# EAGLE design Voicecard-SVF-v0.7 (EAGLE 9.6.2)

## Sheet 1 of 2
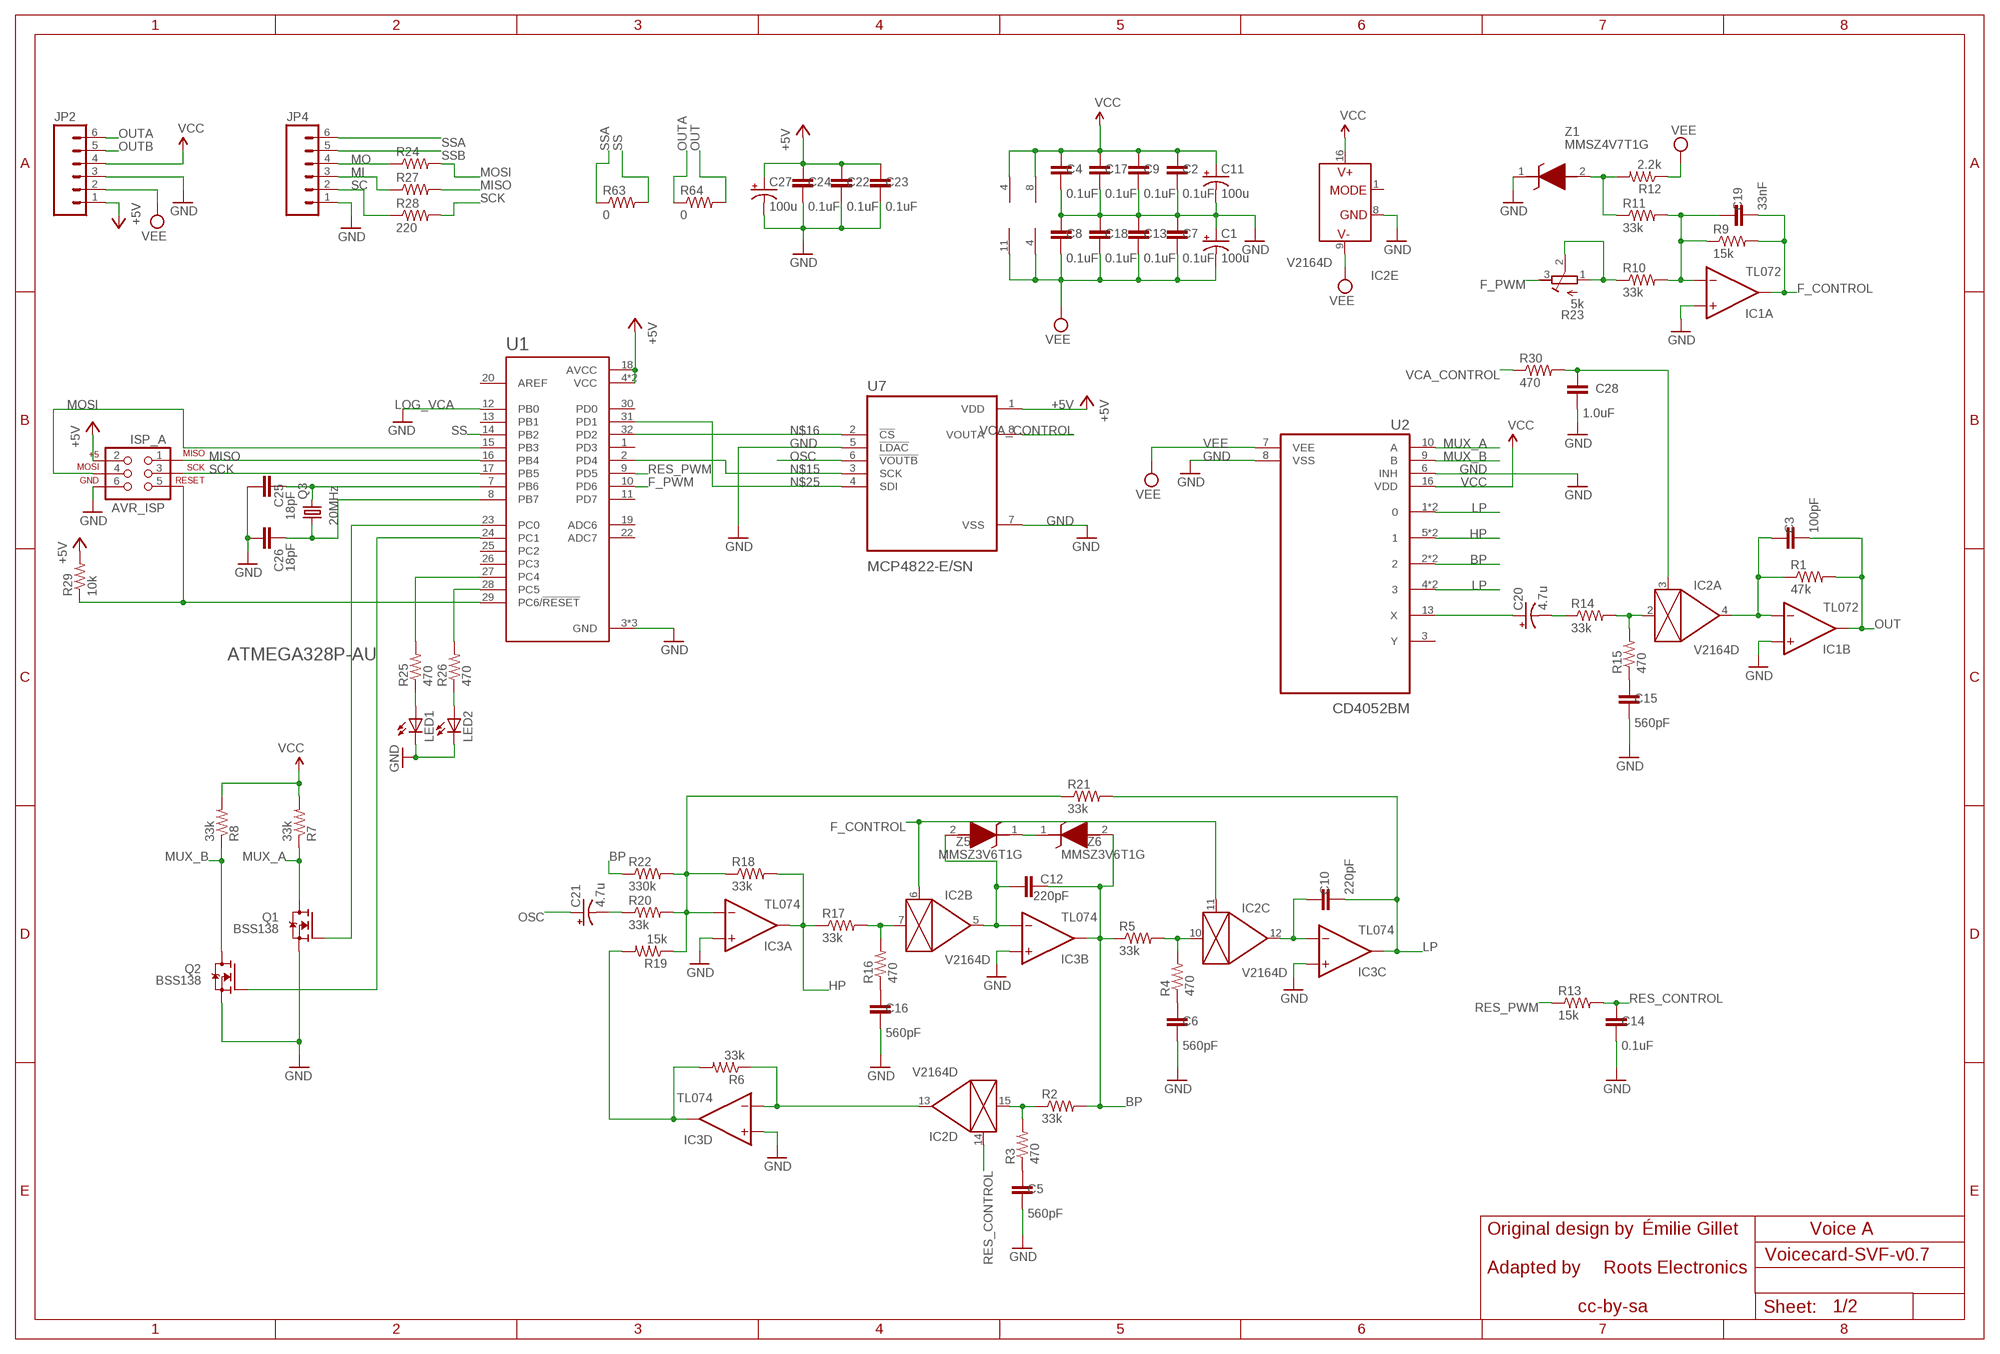
[diagram p0: schematic, sheet 1]

### Parts
C1  100u  CPOL-USC  [PANASONIC_C]
C2  0.1uF  0.1UF-0603-25V-5%  [0603]
C3  100pF  100PF-0603-50V-5%  [0603]
C4  0.1uF  0.1UF-0603-25V-5%  [0603]
C5  560pF  560PF-0603-50V-5%  [0603]
C6  560pF  560PF-0603-50V-5%  [0603]
C7  0.1uF  0.1UF-0603-25V-5%  [0603]
C8  0.1uF  0.1UF-0603-25V-5%  [0603]
C9  0.1uF  0.1UF-0603-25V-5%  [0603]
C10  220pF  270PF-0603-50V-5%  [0603]
C11  100u  CPOL-USC  [PANASONIC_C]
C12  220pF  270PF-0603-50V-5%  [0603]
C13  0.1uF  0.1UF-0603-25V-5%  [0603]
C14  0.1uF  0.1UF-0603-25V-5%  [0603]
C15  560pF  560PF-0603-50V-5%  [0603]
C16  560pF  560PF-0603-50V-5%  [0603]
C17  0.1uF  0.1UF-0603-25V-5%  [0603]
C18  0.1uF  0.1UF-0603-25V-5%  [0603]
C19  33nF  33NF-0603-50V-10%  [0603]
C20  4.7u  CPOL-USA  [PANASONIC_A]
C21  4.7u  CPOL-USA  [PANASONIC_A]
C22  0.1uF  0.1UF-0603-25V-5%  [0603]
C23  0.1uF  0.1UF-0603-25V-5%  [0603]
C24  0.1uF  0.1UF-0603-25V-5%  [0603]
C25  18pF  18PF-0603-50V-5%  [0603]
C26  18pF  18PF-0603-50V-5%  [0603]
C27  100u  CPOL-USC  [PANASONIC_C]
C28  1.0uF  1.0UF-0603-16V-10%  [0603]
IC1  TL072  TL072_SMD  [SO08]
IC2  V2164D  SSM2164S  [SOIC16N]
IC3  TL074  TL074_SMD  [SO14]
ISP_A  AVR_ISP  AVR_SPI_PRG_6PTH  [2X3]
JP2  M06SIP  [1X06]
JP4  M06SIP  [1X06]
LED1  LED3MM  [LED3MM]
LED2  LED3MM  [LED3MM]
Q1  BSS138  [SOT95P240X111-3N]
Q2  BSS138  [SOT95P240X111-3N]
Q3  20MHz  CRYSTALHC49UP  [HC49UP]
R1  47k  47KOHM-0603-1/10W-1%  [0603]
R2  33k  33KOHM-0603-1/10W-1%  [0603]
R3  470  470OHM-0603-1/10W-1%  [0603]
R4  470  470OHM-0603-1/10W-1%  [0603]
R5  33k  33KOHM-0603-1/10W-1%  [0603]
R6  33k  33KOHM-0603-1/10W-1%  [0603]
R7  33k  33KOHM-0603-1/10W-1%  [0603]
R8  33k  33KOHM-0603-1/10W-1%  [0603]
R9  15k  15KOHM-0603-1/10W-1%  [0603]
R10  33k  33KOHM-0603-1/10W-1%  [0603]
R11  33k  33KOHM-0603-1/10W-1%  [0603]
R12  2.2k  2.2KOHM-0603-1/10W-1%  [0603]
R13  15k  15KOHM-0603-1/10W-1%  [0603]
R14  33k  33KOHM-0603-1/10W-1%  [0603]
R15  470  470OHM-0603-1/10W-1%  [0603]
R16  470  470OHM-0603-1/10W-1%  [0603]
R17  33k  33KOHM-0603-1/10W-1%  [0603]
R18  33k  33KOHM-0603-1/10W-1%  [0603]
R19  15k  15KOHM-0603-1/10W-1%  [0603]
R20  33k  33KOHM-0603-1/10W-1%  [0603]
R21  33k  33KOHM-0603-1/10W-1%  [0603]
R22  330k  330KOHM-0603-1/10W-1%  [0603]
R23  5k  R-TRIMM3296P  [RTRIM3296P]
R24  220  220OHM-0603-1/10W-1%  [0603]
R25  470  470OHM-0603-1/10W-1%  [0603]
R26  470  470OHM-0603-1/10W-1%  [0603]
R27  220  220OHM-0603-1/10W-1%  [0603]
R28  220  220OHM-0603-1/10W-1%  [0603]
R29  10k  10KOHM-0603-1/10W-1%  [0603]
R30  470  470OHM-0603-1/10W-1%  [0603]
R63  0  220OHM-0603-1/10W-1%  [0603]
R64  0  220OHM-0603-1/10W-1%  [0603]
U1  ATMEGA328P-AU  [QFP80P900X900X120-32N]
U2  CD4052BM  [SOIC127P600X175-16N]
U7  MCP4822-E/SN  [SOIC127P599X175-8N]
Z1  MMSZ4V7T1G  [SOD3716X135N]
Z5  MMSZ3V6T1G  [SOD3716X135N]
Z6  MMSZ3V6T1G  [SOD3716X135N]

### Nets
+5V: C22.1 C23.1 C24.1 C27.+ ISP_A.2 JP2.1 R29.2 U1.4(VCC) U1.6(VCC) U1.18(AVCC) U7.1(VDD) ; also sheet 2
BP: C12.2 IC3.7(B:OUT) R2.2 R5.1 R22.1 U2.2 U2.15 Z6.2(A)
F_CONTROL: C19.2 IC1.1(A:OUT) IC2.6(B:CTRL) IC2.11(C:CTRL) R9.2
F_PWM: R23.3(A) U1.10(PD6)
GND: C1.+ C2.2 C4.2 C5.2 C6.2 C7.1 C8.1 C9.2 C11.- C13.1 C14.2 C15.2 C16.2 C17.2 C18.1 C22.2 C23.2 C24.2 C25.1 C26.1 C27.- C28.2 IC1.3(A:+IN) IC1.5(B:+IN) IC2.8(E:GND) IC3.3(A:+IN) IC3.5(B:+IN) IC3.10(C:+IN) IC3.12(D:+IN) ISP_A.6 JP2.3 JP4.1 LED1.K(C) LED2.K(C) Q1.2(S) Q2.2(S) U1.3(GND) U1.5(GND) U1.12(PB0) U1.21(GND) U2.6(INH) U2.8(VSS) U7.5(!LDAC) U7.7(VSS) Z1.1(K) ; also sheet 2
HP: IC3.1(A:OUT) R17.1 R18.2 U2.5 U2.14
LEDS0: R25.2 U1.27(PC4)
LP: C10.2 IC3.8(C:OUT) R21.2 U2.1 U2.4 U2.11 U2.12
MI: JP4.3 R27.1 ; also sheet 2
MISO: ISP_A.1 R27.2 U1.16(PB4)
MO: JP4.4 R24.1 ; also sheet 2
MOSI: ISP_A.4 R24.2 U1.15(PB3)
MUX_A: Q1.3(D) R7.1 U2.10(A)
MUX_B: Q2.3(D) R8.1 U2.9(B)
N$1: C21.- R20.1
N$2: C20.+ U2.13(X)
N$4: Q1.1(G) U1.23(PC0)
N$5: C20.- R14.1
N$6: Q2.1(G) U1.24(PC1)
N$7: LED1.A R25.1
N$9: R11.1 R12.2 Z1.2(A)
N$10: LED2.A R26.1
N$11: R26.2 U1.28(PC5)
N$12: IC3.2(A:-IN) R18.1 R19.1 R20.2 R21.1 R22.2
N$15: U1.2(PD4) U7.3(SCK)
N$16: U1.32(PD2) U7.2(!CS)
N$17: C6.1 R4.1
N$19: C12.1 IC2.5(B:OUT) IC3.6(B:-IN) Z5.2(A)
N$21: IC2.15(D:IN) R2.1 R3.2
N$23: ISP_A.5 R29.1 U1.29(PC6/!RESET)
N$25: U1.31(PD1) U7.4(SDI)
N$26: IC2.10(C:IN) R4.2 R5.2
N$27: C5.1 R3.1
N$28: C10.1 IC2.12(C:OUT) IC3.9(C:-IN)
N$29: IC2.7(B:IN) R16.2 R17.2
N$30: C16.1 R16.1
N$31: IC2.13(D:OUT) IC3.13(D:-IN) R6.1
N$40: C19.1 IC1.2(A:-IN) R9.1 R10.2 R11.2
N$41: R10.1 R23.1(E) R23.2(S)
N$48: IC3.14(D:OUT) R6.2 R19.2
N$59: Z5.1(K) Z6.1(K)
N$65: C15.1 R15.1
N$67: IC2.2(A:IN) R14.2 R15.2
N$77: C3.1 IC1.6(B:-IN) IC2.4(A:OUT) R1.1
N$82: C26.2 Q3.1 U1.8(PB7)
N$83: C25.2 Q3.2 U1.7(PB6)
NET55: C28.1 IC2.3(A:CTRL) R30.2
OSC: C21.+ U7.6(!VOUTB)
OUT: C3.2 IC1.7(B:OUT) R1.2 R64.2
OUTA: JP2.6 R64.1
OUTB: JP2.5 ; also sheet 2
RES_CONTROL: C14.1 IC2.14(D:CTRL) R13.2
RES_PWM: R13.1 U1.9(PD5)
SC: JP4.2 R28.1 ; also sheet 2
SCK: ISP_A.3 R28.2 U1.17(PB5)
SS: R63.2 U1.14(PB2)
SSA: JP4.6 R63.1
SSB: JP4.5 ; also sheet 2
VCA_CONTROL: R30.1 U7.8(VOUTA)
VCC: C2.1 C4.1 C9.1 C11.+ C17.1 IC1.8(P:V+) IC2.16(E:V+) IC3.4(P:V+) JP2.4 R7.2 R8.2 U2.16(VDD) ; also sheet 2
VEE: C1.- C7.2 C8.2 C13.2 C18.2 IC1.4(P:V-) IC2.9(E:V-) IC3.11(P:V-) JP2.2 R12.1 U2.7(VEE) ; also sheet 2
Unconnected: IC2.1(E:MODE) U1.1(PD3) U1.11(PD7) U1.13(PB1) U1.19(ADC6) U1.20(AREF) U1.22(ADC7) U1.25(PC2) U1.26(PC3) U1.30(PD0) U2.3(Y)

### Notes on the sheet
- LOG_VCA
- Original design by | Émilie Gillet | Voice A
- Adapted by | Roots Electronics
- cc-by-sa

## Sheet 2 of 2
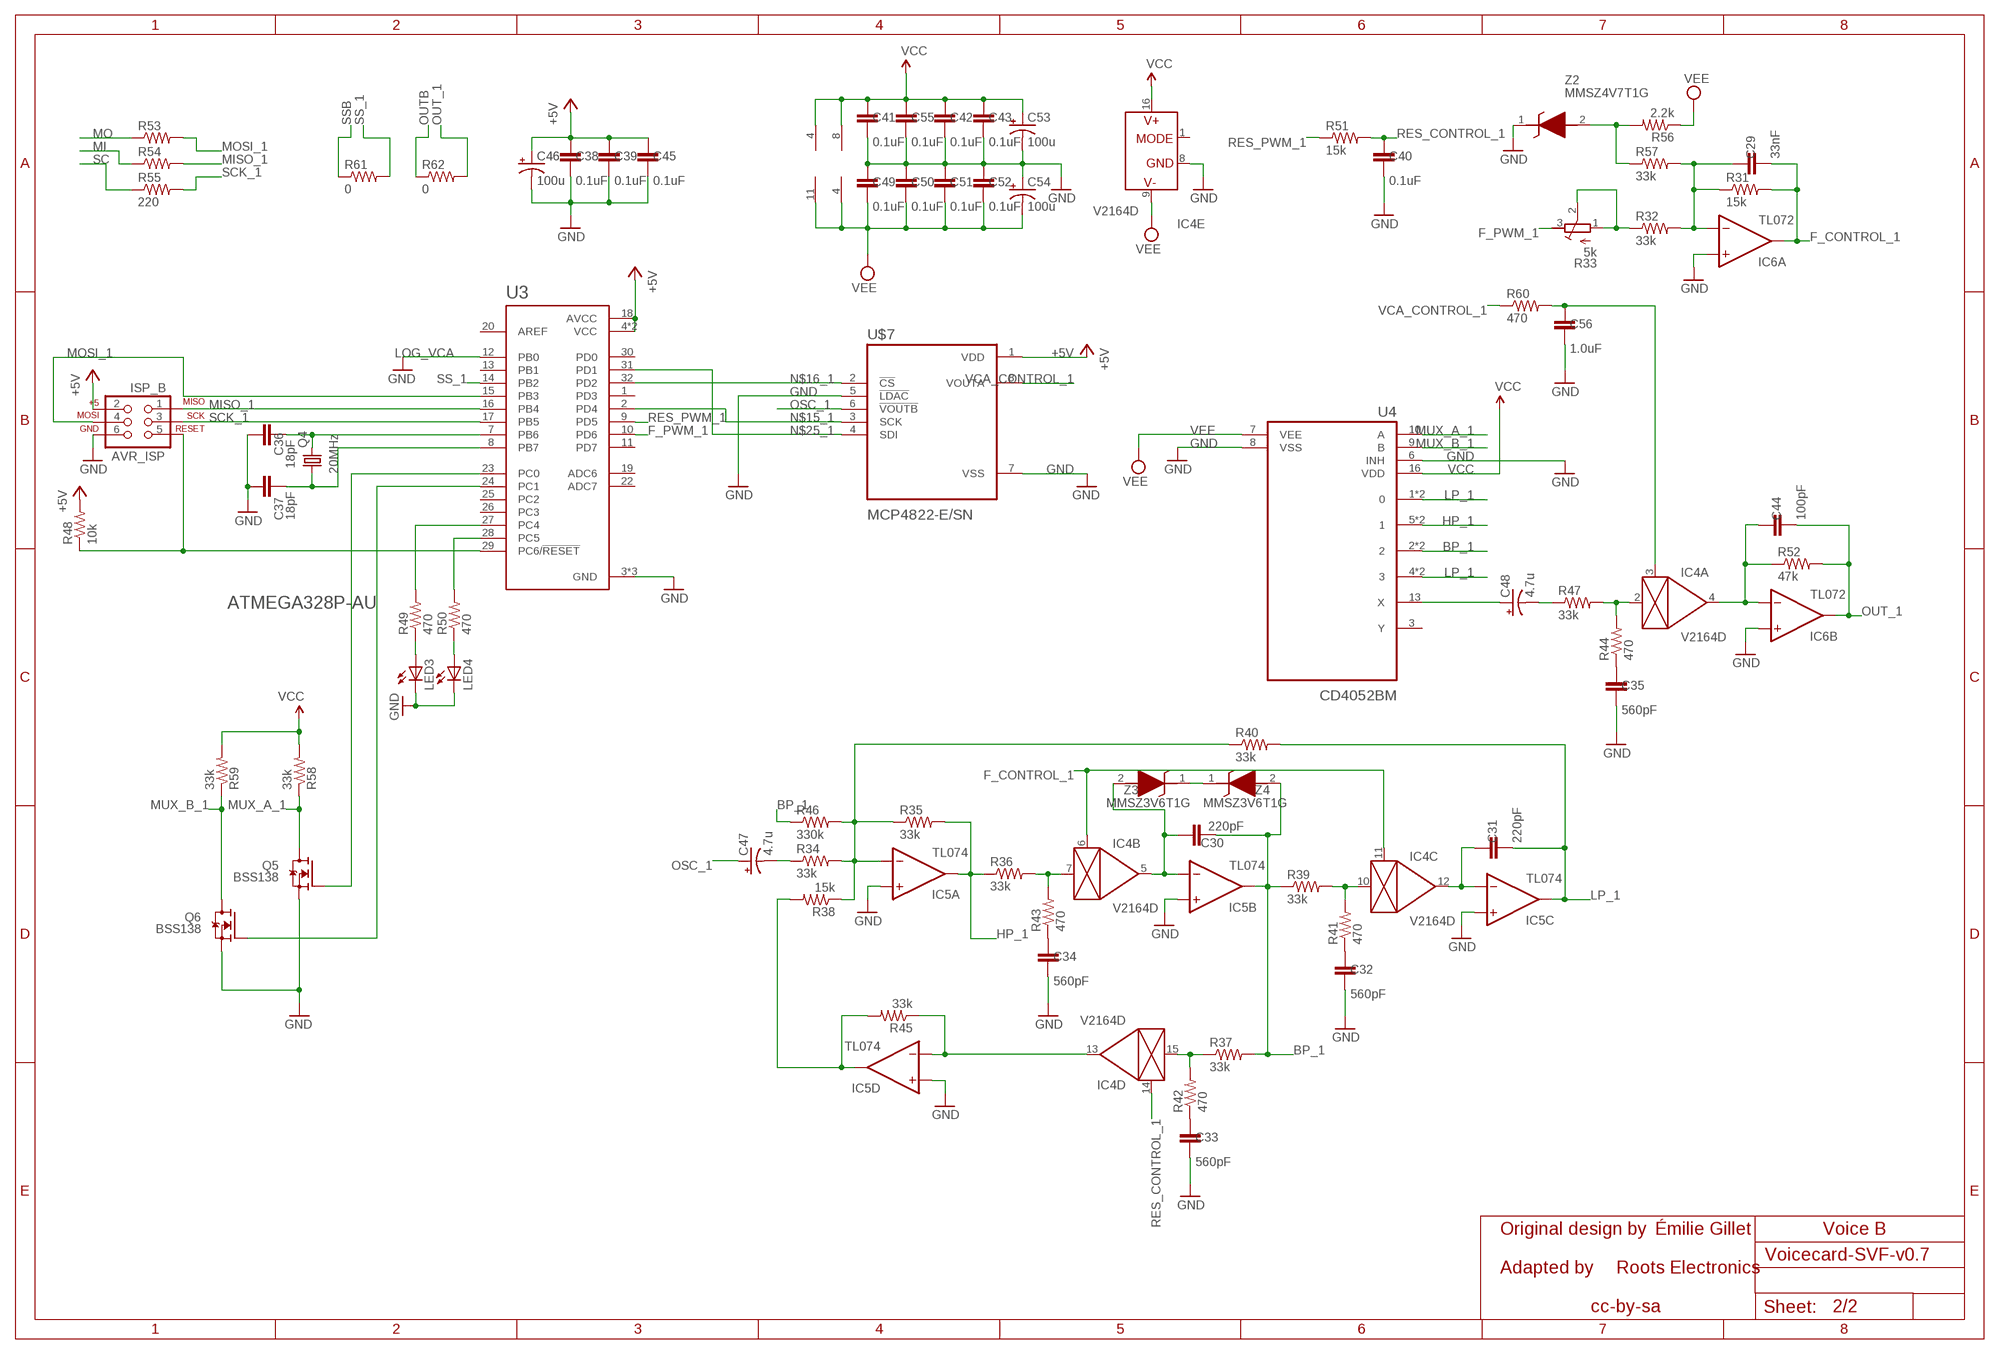
[diagram p1: schematic, sheet 2]

### Parts
C29  33nF  33NF-0603-50V-10%  [0603]
C30  220pF  270PF-0603-50V-5%  [0603]
C31  220pF  270PF-0603-50V-5%  [0603]
C32  560pF  560PF-0603-50V-5%  [0603]
C33  560pF  560PF-0603-50V-5%  [0603]
C34  560pF  560PF-0603-50V-5%  [0603]
C35  560pF  560PF-0603-50V-5%  [0603]
C36  18pF  18PF-0603-50V-5%  [0603]
C37  18pF  18PF-0603-50V-5%  [0603]
C38  0.1uF  0.1UF-0603-25V-5%  [0603]
C39  0.1uF  0.1UF-0603-25V-5%  [0603]
C40  0.1uF  0.1UF-0603-25V-5%  [0603]
C41  0.1uF  0.1UF-0603-25V-5%  [0603]
C42  0.1uF  0.1UF-0603-25V-5%  [0603]
C43  0.1uF  0.1UF-0603-25V-5%  [0603]
C44  100pF  100PF-0603-50V-5%  [0603]
C45  0.1uF  0.1UF-0603-25V-5%  [0603]
C46  100u  CPOL-USC  [PANASONIC_C]
C47  4.7u  CPOL-USA  [PANASONIC_A]
C48  4.7u  CPOL-USA  [PANASONIC_A]
C49  0.1uF  0.1UF-0603-25V-5%  [0603]
C50  0.1uF  0.1UF-0603-25V-5%  [0603]
C51  0.1uF  0.1UF-0603-25V-5%  [0603]
C52  0.1uF  0.1UF-0603-25V-5%  [0603]
C53  100u  CPOL-USC  [PANASONIC_C]
C54  100u  CPOL-USC  [PANASONIC_C]
C55  0.1uF  0.1UF-0603-25V-5%  [0603]
C56  1.0uF  1.0UF-0603-16V-10%  [0603]
IC4  V2164D  SSM2164S  [SOIC16N]
IC5  TL074  TL074_SMD  [SO14]
IC6  TL072  TL072_SMD  [SO08]
ISP_B  AVR_ISP  AVR_SPI_PRG_6PTH  [2X3]
LED3  LED3MM  [LED3MM]
LED4  LED3MM  [LED3MM]
Q4  20MHz  CRYSTALHC49UP  [HC49UP]
Q5  BSS138  [SOT95P240X111-3N]
Q6  BSS138  [SOT95P240X111-3N]
R31  15k  15KOHM-0603-1/10W-1%  [0603]
R32  33k  33KOHM-0603-1/10W-1%  [0603]
R33  5k  R-TRIMM3296P  [RTRIM3296P]
R34  33k  33KOHM-0603-1/10W-1%  [0603]
R35  33k  33KOHM-0603-1/10W-1%  [0603]
R36  33k  33KOHM-0603-1/10W-1%  [0603]
R37  33k  33KOHM-0603-1/10W-1%  [0603]
R38  15k  15KOHM-0603-1/10W-1%  [0603]
R39  33k  33KOHM-0603-1/10W-1%  [0603]
R40  33k  33KOHM-0603-1/10W-1%  [0603]
R41  470  470OHM-0603-1/10W-1%  [0603]
R42  470  470OHM-0603-1/10W-1%  [0603]
R43  470  470OHM-0603-1/10W-1%  [0603]
R44  470  470OHM-0603-1/10W-1%  [0603]
R45  33k  33KOHM-0603-1/10W-1%  [0603]
R46  330k  330KOHM-0603-1/10W-1%  [0603]
R47  33k  33KOHM-0603-1/10W-1%  [0603]
R48  10k  10KOHM-0603-1/10W-1%  [0603]
R49  470  470OHM-0603-1/10W-1%  [0603]
R50  470  470OHM-0603-1/10W-1%  [0603]
R51  15k  15KOHM-0603-1/10W-1%  [0603]
R52  47k  47KOHM-0603-1/10W-1%  [0603]
R53  220  220OHM-0603-1/10W-1%  [0603]
R54  220  220OHM-0603-1/10W-1%  [0603]
R55  220  220OHM-0603-1/10W-1%  [0603]
R56  2.2k  2.2KOHM-0603-1/10W-1%  [0603]
R57  33k  33KOHM-0603-1/10W-1%  [0603]
R58  33k  33KOHM-0603-1/10W-1%  [0603]
R59  33k  33KOHM-0603-1/10W-1%  [0603]
R60  470  470OHM-0603-1/10W-1%  [0603]
R61  0  220OHM-0603-1/10W-1%  [0603]
R62  0  220OHM-0603-1/10W-1%  [0603]
U3  ATMEGA328P-AU  [QFP80P900X900X120-32N]
U4  CD4052BM  [SOIC127P600X175-16N]
U$7  MCP4822-E/SN  [SOIC127P599X175-8N]
Z2  MMSZ4V7T1G  [SOD3716X135N]
Z3  MMSZ3V6T1G  [SOD3716X135N]
Z4  MMSZ3V6T1G  [SOD3716X135N]

### Nets
+5V: C38.1 C39.1 C45.1 C46.+ ISP_B.2 R48.2 U3.4(VCC) U3.6(VCC) U3.18(AVCC) U$7.1(VDD) ; also sheet 1
BP_1: C30.2 IC5.7(B:OUT) R37.2 R39.1 R46.1 U4.2 U4.15 Z4.2(A)
F_CONTROL_1: C29.2 IC4.6(B:CTRL) IC4.11(C:CTRL) IC6.1(A:OUT) R31.2
F_PWM_1: R33.3(A) U3.10(PD6)
GND: C32.2 C33.2 C34.2 C35.2 C36.1 C37.1 C38.2 C39.2 C40.2 C41.2 C42.2 C43.2 C45.2 C46.- C49.1 C50.1 C51.1 C52.1 C53.- C54.+ C55.2 C56.2 IC4.8(E:GND) IC5.3(A:+IN) IC5.5(B:+IN) IC5.10(C:+IN) IC5.12(D:+IN) IC6.3(A:+IN) IC6.5(B:+IN) ISP_B.6 LED3.K(C) LED4.K(C) Q5.2(S) Q6.2(S) U3.3(GND) U3.5(GND) U3.12(PB0) U3.21(GND) U4.6(INH) U4.8(VSS) U$7.5(!LDAC) U$7.7(VSS) Z2.1(K) ; also sheet 1
HP_1: IC5.1(A:OUT) R35.2 R36.1 U4.5 U4.14
LEDS1_1: R49.2 U3.27(PC4)
LP_1: C31.2 IC5.8(C:OUT) R40.2 U4.1 U4.4 U4.11 U4.12
MI: R54.1 ; also sheet 1
MISO_1: ISP_B.1 R54.2 U3.16(PB4)
MO: R53.1 ; also sheet 1
MOSI_1: ISP_B.4 R53.2 U3.15(PB3)
MUX_A_1: Q5.3(D) R58.1 U4.10(A)
MUX_B_1: Q6.3(D) R59.1 U4.9(B)
N$3: C29.1 IC6.2(A:-IN) R31.1 R32.2 R57.2
N$8: R32.1 R33.1(E) R33.2(S)
N$13: C44.1 IC4.4(A:OUT) IC6.6(B:-IN) R52.1
N$14: IC5.2(A:-IN) R34.2 R35.1 R38.1 R40.1 R46.2
N$15_1: U3.2(PD4) U$7.3(SCK)
N$16_1: U3.32(PD2) U$7.2(!CS)
N$18: C30.1 IC4.5(B:OUT) IC5.6(B:-IN) Z3.2(A)
N$20: IC4.10(C:IN) R39.2 R41.2
N$22: C31.1 IC4.12(C:OUT) IC5.9(C:-IN)
N$24: C32.1 R41.1
N$25_1: U3.31(PD1) U$7.4(SDI)
N$32: C33.1 R42.1
N$33: IC4.7(B:IN) R36.2 R43.2
N$34: C34.1 R43.1
N$35: C35.1 R44.1
N$36: IC4.2(A:IN) R44.2 R47.2
N$37: IC4.15(D:IN) R37.1 R42.2
N$38: IC4.13(D:OUT) IC5.13(D:-IN) R45.1
N$39: IC5.14(D:OUT) R38.2 R45.2
N$42: Z3.1(K) Z4.1(K)
N$43: C47.- R34.1
N$44: C48.- R47.1
N$45: C37.2 Q4.1 U3.8(PB7)
N$46: C36.2 Q4.2 U3.7(PB6)
N$47: LED3.A R49.1
N$49: LED4.A R50.1
N$50: R50.2 U3.28(PC5)
N$51: R56.2 R57.1 Z2.2(A)
N$52: ISP_B.5 R48.1 U3.29(PC6/!RESET)
N$53: Q5.1(G) U3.23(PC0)
N$54: Q6.1(G) U3.24(PC1)
N$56: C48.+ U4.13(X)
NET1: C56.1 IC4.3(A:CTRL) R60.2
OSC_1: C47.+ U$7.6(!VOUTB)
OUT_1: C44.2 IC6.7(B:OUT) R52.2 R62.2
OUTB: R62.1 ; also sheet 1
RES_CONTROL_1: C40.1 IC4.14(D:CTRL) R51.2
RES_PWM_1: R51.1 U3.9(PD5)
SC: R55.1 ; also sheet 1
SCK_1: ISP_B.3 R55.2 U3.17(PB5)
SS_1: R61.2 U3.14(PB2)
SSB: R61.1 ; also sheet 1
VCA_CONTROL_1: R60.1 U$7.8(VOUTA)
VCC: C41.1 C42.1 C43.1 C53.+ C55.1 IC4.16(E:V+) IC5.4(P:V+) IC6.8(P:V+) R58.2 R59.2 U4.16(VDD) ; also sheet 1
VEE: C49.2 C50.2 C51.2 C52.2 C54.- IC4.9(E:V-) IC5.11(P:V-) IC6.4(P:V-) R56.1 U4.7(VEE) ; also sheet 1
Unconnected: IC4.1(E:MODE) U3.1(PD3) U3.11(PD7) U3.13(PB1) U3.19(ADC6) U3.20(AREF) U3.22(ADC7) U3.25(PC2) U3.26(PC3) U3.30(PD0) U4.3(Y)

### Notes on the sheet
- LOG_VCA
- Original design by | Émilie Gillet | Voice B
- Adapted by | Roots Electronics
- cc-by-sa

## Library data of the parts
C1 C11 C20 C21 C27 C46-C48 C53 C54 = adafruit:CPOL-US: POLARIZED CAPACITOR, American symbol
C2 C4 C7-C9 C13 C14 C17 C18 C22-C24 C38-C43 C45 C49-C52 C55 = SparkFun-Capacitors:0.1UF: 0.1µF ceramic capacitors A capacitor is a passive two-terminal electrical component used to store electrical energy temporarily in an electric field.; PROD_ID: CAP-08604
C3 C44 = SparkFun-Capacitors:100PF: 100pF/0.1nF ceramic capacitors A capacitor is a passive two-terminal electrical component used to store electrical energy temporarily in an electric field.; PROD_ID: CAP-07883
C5 C6 C15 C16 C32-C35 = SparkFun-Capacitors:560PF: 0.56nF/560pF ceramic capacitors A capacitor is a passive two-terminal electrical component used to store electrical energy temporarily in an electric field.; PROD_ID: CAP-08749
C10 C12 C30 C31 = SparkFun-Capacitors:270PF: 270pF/0.27nF ceramic capacitors A capacitor is a passive two-terminal electrical component used to store electrical energy temporarily in an electric field.; PROD_ID: CAP-13339; VALUE: 270PF
C19 C29 = SparkFun-Capacitors:33NF: 33nF ceramic capacitors A capacitor is a passive two-terminal electrical component used to store electrical energy temporarily in an electric field.; PROD_ID: CAP-07887
C25 C26 C36 C37 = SparkFun-Capacitors:18PF: 18pF ceramic capacitors A capacitor is a passive two-terminal electrical component used to store electrical energy temporarily in an electric field.; PROD_ID: CAP-08267
C28 C56 = SparkFun-Capacitors:1.0UF: 1µF ceramic capacitors A capacitor is a passive two-terminal electrical component used to store electrical energy temporarily in an electric field.; PROD_ID: CAP-00868
IC1 IC6 = MusicThingModular:TL072: Generic Dual Op Amp
IC2 IC4 = ssm2164_2:SSM2164
IC3 IC5 = MusicThingModular:TL074: Generic Quad Op Amp
ISP_A ISP_B = SparkFun:AVR_SPI_PRG_6: AVR ISP 6 Pin This is the reduced ISP connector for AVR programming. Common on Arduino. This footprint will take up less PCB space and can be used with a 10-pin to 6-pin adapter such as SKU: BOB-08508
JP2 JP4 = SparkFun:M06: Header 6 Standard 6-pin 0.1" header. Use with straight break away headers (SKU : PRT-00116), right angle break away headers (PRT-00553), swiss pins (PRT-00743), machine pins (PRT-00117), and female headers (PRT-00115). Molex polarized connector foot print use with SKU : PRT-08094 with associated crimp pins and housings. NOTES ON THE VARIANTS LOCK and LOCK_LONGPADS... This footprint was designed to help hold the alignment of a through-hole component (i.e. 6-pin header) while soldering it into place. You may notice that each hole has been shifted either up or down by 0.005 of an inch from it's more standard position (which is a perfectly straight line). This slight alteration caused the pins (the squares in the middle) to touch the edges of the holes. Because they are alternating, it causes a "brace" to hold the component in place. 0.005 has proven to be the perfect amount of "off-center" position when using our standard breakaway headers. Although looks a little odd when you look at the bare footprint, once you have a header in there, the alteration is very hard to notice. Also, if you push a header all the way into place, it is covered up entirely on the bottom side. This idea of altering the position of holes to aid alignment will be further integrated into the Sparkfun Library for other footprints. It can help hold any component with 3 or more connection pins.
LED1-LED4 = led:LED: LED OSRAM: - CHIPLED LG R971, LG N971, LY N971, LG Q971, LY Q971, LO R971, LY R971 LH N974, LH R974 LS Q976, LO Q976, LY Q976 LO Q996 - Hyper CHIPLED LW Q18S LB Q993, LB Q99A, LB R99A - SideLED LS A670, LO A670, LY A670, LG A670, LP A670 LB A673, LV A673, LT A673, LW A673 LH A674 LY A675 LS A676, LA A676, LO A676, LY A676, LW A676 LS A679, LY A679, LG A679 - Hyper Micro SIDELED® LS Y876, LA Y876, LO Y876, LY Y876 LT Y87S - SmartLED LW L88C, LW L88S LB L89C, LB L89S, LG L890 LS L89K, LO L89K, LY L89K LS L896, LA L896, LO L896, LY L896 - TOPLED LS T670, LO T670, LY T670, LG T670, LP T670 LSG T670, LSP T670, LSY T670, LOP T670, LYG T670 LG T671, LOG T671, LSG T671 LB T673, LV T673, LT T673, LW T673 LH T674 LS T676, LA T676, LO T676, LY T676, LB T676, LH T676, LSB T676, LW T676 LB T67C, LV T67C, LT T67C, LS T67K, LO T67K, LY T67K, LW E67C LS E67B, LA E67B, LO E67B, LY E67B, LB E67C, LV E67C, LT E67C LW T67C LS T679, LY T679, LG T679 LS T770, LO T770, LY T770, LG T770, LP T770 LB T773, LV T773, LT T773, LW T773 LH T774 LS E675, LA E675, LY E675, LS T675 LS T776, LA T776, LO T776, LY T776, LB T776 LHGB T686 LT T68C, LB T68C - Hyper Mini TOPLED® LB M676 - Mini TOPLED Santana® LG M470 LS M47K, LO M47K, LY M47K Source: http://www.osram.convergy.de LUXEON: - LUMILED® LXK2-PW12-R00, LXK2-PW12-S00, LXK2-PW14-U00, LXK2-PW14-V00 LXK2-PM12-R00, LXK2-PM12-S00, LXK2-PM14-U00 LXK2-PE12-Q00, LXK2-PE12-R00, LXK2-PE12-S00, LXK2-PE14-T00, LXK2-PE14-U00 LXK2-PB12-K00, LXK2-PB12-L00, LXK2-PB12-M00, LXK2-PB14-N00, LXK2-PB14-P00, LXK2-PB14-Q00 LXK2-PR12-L00, LXK2-PR12-M00, LXK2-PR14-Q00, LXK2-PR14-R00 LXK2-PD12-Q00, LXK2-PD12-R00, LXK2-PD12-S00 LXK2-PH12-R00, LXK2-PH12-S00 LXK2-PL12-P00, LXK2-PL12-Q00, LXK2-PL12-R00 Source: www.luxeon.com KINGBRIGHT: KA-3528ASYC Source: www.kingbright.com
Q1 Q2 Q5 Q6 = BSS138:BSS138: N-Channel 50V 220mA (Ta) 360mW (Ta) Surface Mount SOT-23-3 Check prices <https://pricing.snapeda.com/parts/BSS138/ON%20Semiconductor/view-part?ref=eda>; AVAILABILITY: Good; DESCRIPTION: N-Channel 50V 220mA (Ta) 360mW (Ta) Surface Mount SOT-23-3; MF: ON Semiconductor; MP: BSS138; PACKAGE: SOT-23 ON Semiconductor; PRICE: None; PURCHASE-URL: https://pricing.snapeda.com/search/part/BSS138/?ref=eda
Q3 Q4 = crystal:CRYSTAL: CRYSTAL; OC_FARNELL: unknown; OC_NEWARK: unknown
R1 R52 = SparkFun-Resistors:47KOHM: 47kΩ resistor A resistor is a passive two-terminal electrical component that implements electrical resistance as a circuit element. Resistors act to reduce current flow, and, at the same time, act to lower voltage levels within circuits. - Wikipedia; PROD_ID: RES-07871
R2 R5-R8 R10 R11 R14 R17 R18 R20 R21 R32 R34-R37 R39 R40 R45 R47 R57-R59 = SparkFun-Resistors:33KOHM: 33kΩ resistor A resistor is a passive two-terminal electrical component that implements electrical resistance as a circuit element. Resistors act to reduce current flow, and, at the same time, act to lower voltage levels within circuits. - Wikipedia; PROD_ID: RES-08416
R3 R4 R15 R16 R25 R26 R30 R41-R44 R49 R50 R60 = SparkFun-Resistors:470OHM: 470Ω resistor A resistor is a passive two-terminal electrical component that implements electrical resistance as a circuit element. Resistors act to reduce current flow, and, at the same time, act to lower voltage levels within circuits. - Wikipedia; PROD_ID: RES-07869
R9 R13 R19 R31 R38 R51 = SparkFun-Resistors:15KOHM: 15kΩ resistor A resistor is a passive two-terminal electrical component that implements electrical resistance as a circuit element. Resistors act to reduce current flow, and, at the same time, act to lower voltage levels within circuits. - Wikipedia; PROD_ID: RES-07854
R12 R56 = SparkFun-Resistors:2.2KOHM: 2.2kΩ resistor A resistor is a passive two-terminal electrical component that implements electrical resistance as a circuit element. Resistors act to reduce current flow, and, at the same time, act to lower voltage levels within circuits. - Wikipedia; PROD_ID: RES-08272
R22 R46 = SparkFun-Resistors:330KOHM: 330kΩ resistor A resistor is a passive two-terminal electrical component that implements electrical resistance as a circuit element. Resistors act to reduce current flow, and, at the same time, act to lower voltage levels within circuits. - Wikipedia; PROD_ID: RES-08968
R23 R33 = rcl:R-TRIMM: Trimm resistor
R24 R27 R28 R53-R55 = SparkFun-Resistors:220OHM: 220Ω resistor A resistor is a passive two-terminal electrical component that implements electrical resistance as a circuit element. Resistors act to reduce current flow, and, at the same time, act to lower voltage levels within circuits. - Wikipedia; PROD_ID: RES-07861
R29 R48 = SparkFun-Resistors:10KOHM: 10kΩ resistor A resistor is a passive two-terminal electrical component that implements electrical resistance as a circuit element. Resistors act to reduce current flow, and, at the same time, act to lower voltage levels within circuits. - Wikipedia; PROD_ID: RES-00824
R61-R64 = SparkFun-Resistors:220OHM: 220Ω resistor A resistor is a passive two-terminal electrical component that implements electrical resistance as a circuit element. Resistors act to reduce current flow, and, at the same time, act to lower voltage levels within circuits. - Wikipedia; PROD_ID: RES-07861; VALUE: 220
U1 U3 = ATMEGA328P-AU:ATMEGA328P-AU: ATmega Series 20 MHz 32 KB Flash 2 KB SRAM 8-Bit Microcontroller - TQFP-32 Check prices <https://pricing.snapeda.com/parts/ATMEGA328P-AU/Microchip%20Technology/view-part?ref=eda>; AVAILABILITY: Good; DESCRIPTION: IC MCU 8BIT 32KB FLASH 32TQFP; MF: Microchip Technology; MP: ATMEGA328P-AU; PACKAGE: TQFP-32 Microchip Technology; PRICE: None; PURCHASE-URL: https://pricing.snapeda.com/search/part/ATMEGA328P-AU/?ref=eda
U2 U4 = CD4052BM:CD4052BM: Check prices <https://pricing.snapeda.com/parts/CD4052BM/Texas%20Instruments/view-part?ref=eda>; AVAILABILITY: Good; DESCRIPTION: 20-V, 4:1, 2-channel general-purpose multiplexer 16-SOIC -55 to 125; MF: Texas Instruments; MP: CD4052BM; PACKAGE: SOIC-16 Texas Instruments; PRICE: None; PURCHASE-URL: https://pricing.snapeda.com/search/part/CD4052BM/?ref=eda
U7 U$7 = MCP4822-E_SN:MCP4822-E/SN: Check prices <https://pricing.snapeda.com/parts/MCP4822-E/SN/Microchip/view-part?ref=eda>; AVAILABILITY: Good; DESCRIPTION: 12 Bit Digital to Analog Converter 2 8-SOIC; MF: Microchip; MP: MCP4822-E/SN; PACKAGE: SOIC-8 Microchip; PRICE: None; PURCHASE-URL: https://pricing.snapeda.com/search/part/MCP4822-E/SN/?ref=eda
Z1 Z2 = SamacSys_Parts:MMSZ4V7T1G: 500 mW, 4.7 V +/-5% ZenerDiodeVoltage Regulator Source: Datasheet <http://www.onsemi.com/pub/Collateral/MMSZ2V4T1-D.PDF>; DESCRIPTION: 500 mW, 4.7 V +/-5% ZenerDiodeVoltage Regulator; HEIGHT: 1.35mm; MANUFACTURER_NAME: ON Semiconductor; MANUFACTURER_PART_NUMBER: MMSZ4V7T1G; MOUSER_PART_NUMBER: 863-MMSZ4V7T1G; MOUSER_PRICE-STOCK: https://www.mouser.co.uk/ProductDetail/ON-Semiconductor/MMSZ4V7T1G/?qs=P4IOph%252Bbot%2F%2F6Vqi0IwDZQ%3D%3D
Z3-Z6 = SamacSys_Parts:MMSZ3V6T1G: 500 mW 3.6 V +/-5% ZenerDiodeVoltage Regulator Source: Datasheet <http://www.onsemi.com/pub/Collateral/MMSZ2V4T1-D.PDF>; DESCRIPTION: 500 mW 3.6 V +/-5% ZenerDiodeVoltage Regulator; HEIGHT: 1.35mm; MANUFACTURER_NAME: ON Semiconductor; MANUFACTURER_PART_NUMBER: MMSZ3V6T1G; MOUSER_PART_NUMBER: 863-MMSZ3V6T1G; MOUSER_PRICE-STOCK: https://www.mouser.co.uk/ProductDetail/ON-Semiconductor/MMSZ3V6T1G/?qs=P4IOph%252Bbot9%252BVUKWse7g7w%3D%3D

## Board
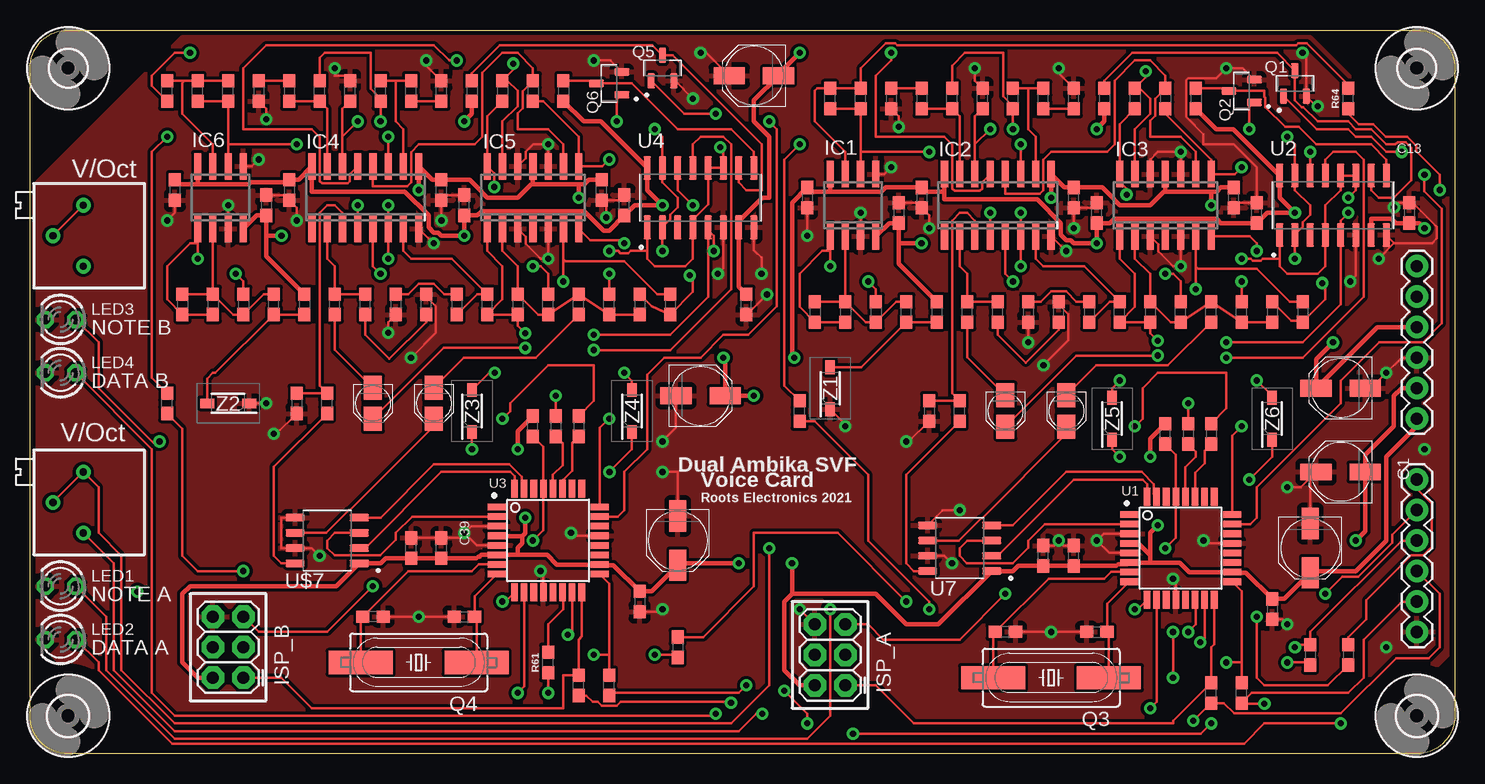
[diagram p2: board, top side]
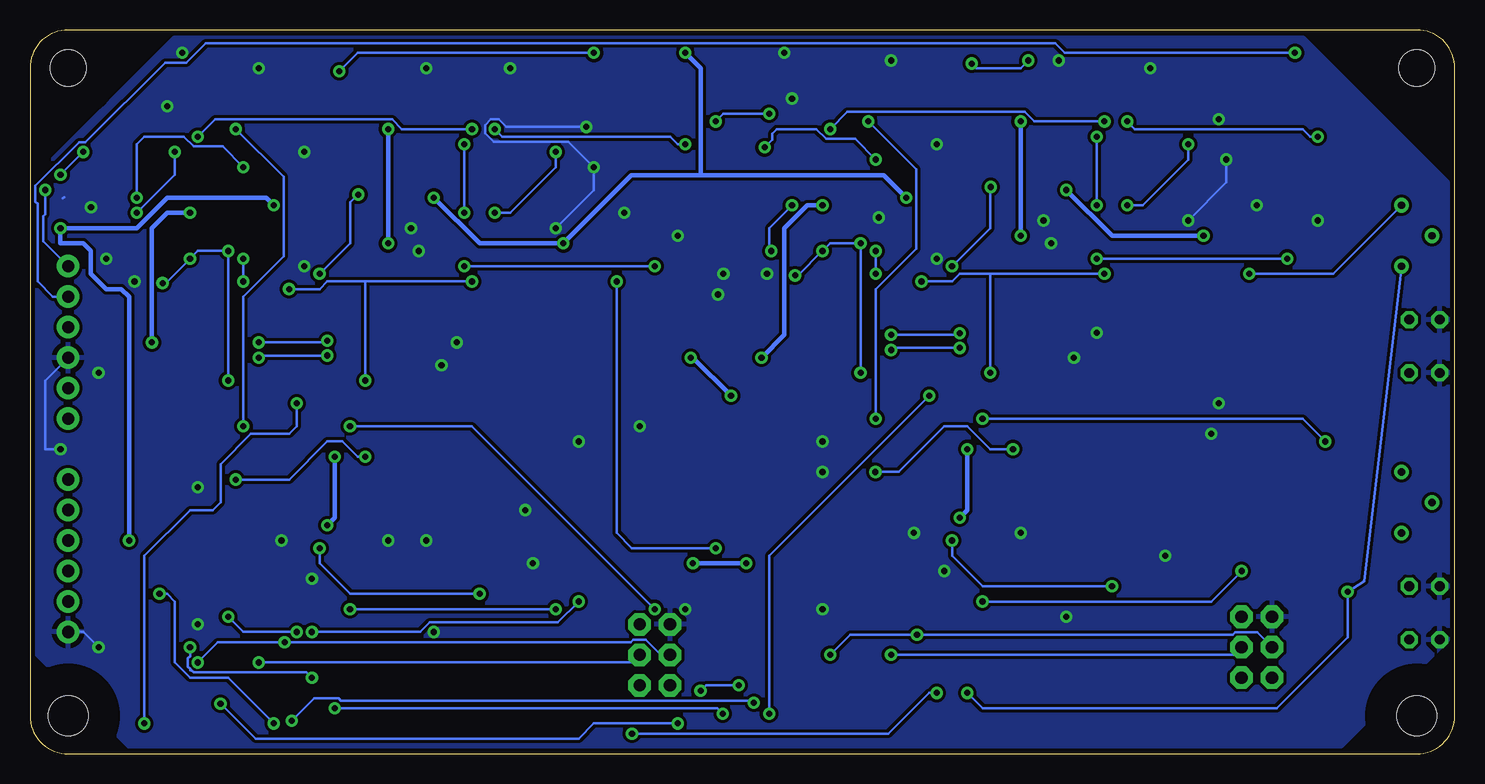
[diagram p3: board, bottom side, seen from below]

Size 118.75 x 60.33 mm. Coordinates in mm from the lower left corner, seen from the top.
Outline: 0,57.15 arc-90 3.17,60.33 115.57,60.33 arc-90 118.75,57.15 118.75,3.17 arc-90 115.57,0 3.17,0 arc-90 0,3.17 0,57.15
Copper layers (1*16): Top 0.035mm / dielectric 1.5mm / Bottom 0.035mm
Design rules "SparkFun *": minimum track width 8mil, minimum drill 20mil, track to track 8mil, track to pad 8mil, pad to pad 8mil, via to via 8mil, smd to smd 8mil, copper to edge 10mil, drill to drill 8mil, minimum pad ring 12mil, minimum via ring 10mil, stop-mask expansion 4mil, vias tented up to drill 25mil, thermal gap 16mil

### Footprints (pad centres in the part's own frame; a part is rotated, then mirrored left to right if it is on the bottom)
PANASONIC_C = smd 2.6 x 1.4: + 2.05,0; - -2.05,0
0603 = smd 1.1 x 1: 1 -0.85,0; 2 0.85,0
PANASONIC_A = smd 2 x 1.5: + 1.3,0; - -1.3,0
SO08 = smd 0.6 x 2.2: 1 -1.905,-2.6; 2 -0.635,-2.6; 3 0.635,-2.6; 4 1.905,-2.6; 5 1.905,2.6; 6 0.635,2.6; 7 -0.635,2.6; 8 -1.905,2.6
SOIC16N = smd 0.6 x 2.2: 1 -4.445,-2.6; 2 -3.175,-2.6; 3 -1.905,-2.6; 4 -0.635,-2.6; 5 0.635,-2.6; 6 1.905,-2.6; 7 3.175,-2.6; 8 4.445,-2.6; 9 4.445,2.6; 10 3.175,2.6; 11 1.905,2.6; 12 0.635,2.6; 13 -0.635,2.6; 14 -1.905,2.6; 15 -3.175,2.6; 16 -4.445,2.6
SO14 = smd 0.6 x 2.2: 1 -3.81,-2.6; 2 -2.54,-2.6; 3 -1.27,-2.6; 4 0,-2.6; 5 1.27,-2.6; 6 2.54,-2.6; 7 3.81,-2.6; 8 3.81,2.6; 9 2.54,2.6; 10 1.27,2.6; 11 0,2.6; 12 -1.27,2.6; 13 -2.54,2.6; 14 -3.81,2.6
2X3 = drill 1.016 pad 1.88 octagon: 1 0,0; 2 0,2.54; 3 2.54,0; 4 2.54,2.54; 5 5.08,0; 6 5.08,2.54
1X06 = drill 1.016 pad 1.88: 1 0,0; 2 2.54,0; 3 5.08,0; 4 7.62,0; 5 10.16,0; 6 12.7,0
LED3MM = drill 0.813 octagon: A -1.27,0; K 1.27,0
SOT95P240X111-3N = smd 1.23 x 0.6: 1 -1.06,0.95; 2 -1.06,-0.95; 3 1.06,0
HC49UP = smd 5.334 x 1.93: 1 -4.826,0; 2 4.826,0
RTRIM3296P = drill 0.61: 1 0,-2.54; 2 2.54,0; 3 0,2.54
QFP80P900X900X120-32N = smd 1.5 x 0.55: 1 -4.3,2.8; 2 -4.3,2; 3 -4.3,1.2; 4 -4.3,0.4; 5 -4.3,-0.4; 6 -4.3,-1.2; 7 -4.3,-2; 8 -4.3,-2.8; 17 4.3,-2.8; 18 4.3,-2; 19 4.3,-1.2; 20 4.3,-0.4; 21 4.3,0.4; 22 4.3,1.2; 23 4.3,2; 24 4.3,2.8 | smd 0.55 x 1.5: 9 -2.8,-4.3; 10 -2,-4.3; 11 -1.2,-4.3; 12 -0.4,-4.3; 13 0.4,-4.3; 14 1.2,-4.3; 15 2,-4.3; 16 2.8,-4.3; 25 2.8,4.3; 26 2,4.3; 27 1.2,4.3; 28 0.4,4.3; 29 -0.4,4.3; 30 -1.2,4.3; 31 -2,4.3; 32 -2.8,4.3
SOIC127P600X175-16N = smd 1.97 x 0.6: 1 -2.475,4.445; 2 -2.475,3.175; 3 -2.475,1.905; 4 -2.475,0.635; 5 -2.475,-0.635; 6 -2.475,-1.905; 7 -2.475,-3.175; 8 -2.475,-4.445; 9 2.475,-4.445; 10 2.475,-3.175; 11 2.475,-1.905; 12 2.475,-0.635; 13 2.475,0.635; 14 2.475,1.905; 15 2.475,3.175; 16 2.475,4.445
SOIC127P599X175-8N = smd 1.58 x 0.6: 1 -2.67,1.905; 2 -2.67,0.635; 3 -2.67,-0.635; 4 -2.67,-1.905; 5 2.67,-1.905; 6 2.67,-0.635; 7 2.67,0.635; 8 2.67,1.905
3,0 = hole 3: 0,0
3,3 = hole 3.3: 0,0
SOD3716X135N = smd 1.15 x 0.8: 1 -1.75,0; 2 1.75,0

### Placement (x,y rotation side)
C1  109.22,23.5 180 top
C2  88.9,45.09 90 top
C3  69.22,54.61 90 top
C4  64.77,46.36 270 top
C5  71.75,54.61 270 top
C6  87,54.61 90 top
C7  87,46.36 90 top
C8  100.33,46.36 90 top
C9  74.3,46.36 270 top
C10  94.61,54.61 270 top
C11  109.22,30.48 180 top
C12  106.05,36.83 270 top
C13  114.94,45.09 270 top
C14  79.38,54.61 90 top
C15  85.72,36.83 90 top
C16  83.19,36.83 270 top
C17  102.23,45.09 90 top
C18  72.39,45.09 270 top
C19  65.41,36.83 270 top
C20  81.28,28.57 270 top
C21  86.36,28.57 270 top
C22  87,16.51 90 top
C23  103.5,12.06 270 top
C24  84.45,16.51 90 top
C25  81.28,10.16 180 top
C26  88.9,10.16 0 top
C27  106.68,17.14 270 top
C28  74.93,28.57 270 top
C29  12.7,37.47 270 top
C30  53.34,37.47 270 top
C31  41.91,55.25 270 top
C32  34.29,55.25 90 top
C33  19.05,55.25 270 top
C34  30.48,37.47 270 top
C35  33.02,37.47 90 top
C36  28.57,11.43 180 top
C37  36.2,11.43 0 top
C38  31.75,17.14 90 top
C39  34.29,17.14 90 top
C40  26.67,55.25 90 top
C41  12.06,46.99 270 top
C42  21.59,46.99 270 top
C43  36.2,45.72 90 top
C44  16.51,55.25 90 top
C45  50.8,12.7 270 top
C46  53.98,17.78 270 top
C47  33.66,29.21 270 top
C48  28.57,29.21 270 top
C49  47.62,46.99 90 top
C50  19.68,45.72 270 top
C51  59.69,37.47 90 top
C52  34.29,46.99 90 top
C53  55.88,29.84 0 top
C54  60.33,56.52 180 top
C55  49.53,45.72 90 top
C56  22.23,29.21 270 top
IC1  68.58,45.72 0 top
IC2  80.64,45.72 0 top
IC3  94.61,45.72 0 top
IC4  27.94,46.36 0 top
IC5  41.91,46.36 0 top
IC6  15.88,46.36 0 top
ISP_A  67.94,5.71 90 top
ISP_B  17.78,6.35 90 top
JP2  115.57,27.94 90 top
JP4  115.57,10.16 90 top
LED1  2.54,13.97 180 top
LED2  2.54,9.53 180 top
LED3  2.54,36.2 180 top
LED4  2.54,31.75 180 top
Q1  105.41,55.88 90 top
Q2  100.97,55.25 180 top
Q3  85.09,6.35 180 top
Q4  32.38,7.62 180 top
Q5  52.7,57.15 90 top
Q6  48.26,55.88 180 top
R1  66.67,54.61 90 top
R2  76.83,54.61 90 top
R3  74.3,54.61 270 top
R4  84.45,54.61 90 top
R5  81.92,54.61 90 top
R6  92.08,54.61 270 top
R7  89.53,54.61 270 top
R8  97.16,54.61 270 top
R9  67.94,36.83 270 top
R10  70.48,36.83 270 top
R11  73.03,36.83 90 top
R12  75.56,36.83 270 top
R13  64.14,28.57 90 top
R14  78.11,36.83 90 top
R15  80.64,36.83 90 top
R16  88.27,36.83 270 top
R17  90.81,36.83 90 top
R18  93.34,36.83 270 top
R19  95.89,36.83 90 top
R20  98.42,36.83 90 top
R21  100.97,36.83 90 top
R22  103.5,36.83 270 top
R23  4.45,20.95 180 top
R24  106.68,8.26 270 top
R25  98.42,26.67 270 top
R26  96.52,26.67 270 top
R27  98.42,5.08 90 top
R28  100.97,5.08 90 top
R29  94.61,26.67 90 top
R30  77.47,28.57 90 top
R31  15.24,37.47 270 top
R32  17.78,37.47 270 top
R33  4.45,43.18 180 top
R34  45.72,37.47 90 top
R35  40.64,37.47 270 top
R36  38.1,37.47 90 top
R37  24.13,55.25 90 top
R38  43.18,37.47 90 top
R39  29.21,55.25 90 top
R40  48.26,37.47 90 top
R41  31.75,55.25 90 top
R42  21.59,55.25 270 top
R43  35.56,37.47 270 top
R44  27.94,37.47 90 top
R45  39.37,55.25 270 top
R46  50.8,37.47 270 top
R47  25.4,37.47 90 top
R48  41.91,27.3 90 top
R49  45.72,27.3 270 top
R50  43.81,27.3 270 top
R51  11.43,29.21 90 top
R52  13.97,55.25 90 top
R53  53.98,8.89 270 top
R54  45.72,5.71 90 top
R55  48.26,5.71 90 top
R56  22.86,37.47 270 top
R57  20.32,37.47 90 top
R58  36.83,55.25 270 top
R59  44.45,55.25 270 top
R60  24.77,29.21 90 top
R61  43.18,7.62 90 top
R62  11.43,55.25 90 top
R63  109.86,8.26 270 top
R64  109.86,54.61 90 top
U1  95.89,17.14 0 top
U2  108.58,45.72 90 top
U3  43.18,17.78 0 top
U4  55.88,46.36 90 top
U7  77.47,17.14 180 top
U$1  [3,0]  3.17,57.15 0 top
U$2  [3,0]  115.57,57.15 0 top
U$5  [3,3]  3.17,3.17 0 top
U$6  [3,3]  115.57,3.17 0 top
U$7  24.77,17.78 180 top
Z1  66.67,30.48 90 top
Z2  16.51,29.21 180 top
Z3  36.83,28.57 90 top
Z4  50.16,28.57 90 top
Z5  90.17,27.94 90 top
Z6  103.5,27.94 90 top

### Tracks (layer width: path | path; a pad name or v marks a point on that pad's centre or on a via)
+5V  (via drill 0.51)
  Top 0.356: JP2.1 115.57,27.3 113.03,24.77 113.03,17.78 110.49,15.24 106.83,15.24 C27.+ 104.5,12.91 C23.1 101.33,15.09 100.23,15.09 U1.18 96.61,15.14 95.81,15.95 93.34,15.95 | 93.34,15.95 U1.6 91.44,15.8 90.68,15.8 90.54,15.66 C22.1 C24.1 82.33,15.66 81.92,15.24 U7.1 75.69,10.79 73.03,10.79 70.48,13.33 63.5,13.33 | 93.34,16.55 92.35,17.54 U1.4 | 93.34,16.55 93.34,15.95 | ISP_A.2 64.14,5.71 62.87,6.98 62.87,12.7 63.5,13.33 | 40.64,16.58 U3.6 37.61,16.58 37.47,16.44 37.34,16.44 37.2,16.3 C39.1 C38.1 29.63,16.3 29.21,15.88 U$7.1 25.53,13.97 13.34,13.97 12.7,13.33 12.7,7.62 13.97,6.35 ISP_B.2 | 40.64,16.58 43.11,16.58 43.91,15.78 U3.18 47.53,15.73 48.62,15.73 C45.1 51.8,13.55 C46.+ 54.12,15.88 v59.05,15.88 | 40.64,16.58 40.64,17.18 41.02,17.57 41.02,18.15 | 63.5,13.33 v63.5,15.88 | 41.02,18.15 41.27,18.4 v41.27,19.68 | v40.64,25.4 40.64,26.88 R48.2 | v93.98,19.05 93.34,18.41 93.34,16.55 | v93.34,24.77 93.34,26.25 R29.2 | 41.02,18.15 38.91,18.15 U3.4
  Bottom 0.356: v63.5,15.88 v59.05,15.88 | v41.27,19.68 40.64,20.32 v40.64,25.4 | v93.98,19.05 93.34,19.68 v93.34,24.77
BP  (via drill 0.51)
  Top 0.203: R2.2 76.83,57.37 77.89,58.42 81.11,58.42 81.11,54.78 81.92,53.98 R5.1 v81.92,52.07 | IC3.7 101.66,43.12 102.23,42.55 v102.23,41.91 | v105.41,41.28 U2.2 106.08,43.91 106.08,44.31 106.68,44.92 106.68,45.72 105.41,46.99 U2.15 105.41,50.8 v104.78,51.44 | v107.7,39.24 107.83,39.37 107.95,39.37 107.95,37.89 106.15,36.09 | 106.15,36.09 C12.2 | 106.15,36.09 105.1,36.09 R22.1 | v102.23,31.11 103.5,29.84 Z6.2
  Bottom 0.203: v102.23,31.11 v102.23,41.91 104.78,41.91 v105.41,41.28 107.45,39.24 v107.7,39.24 | v104.78,51.44 103.33,52.88 88.56,52.88 87.75,52.07 v81.92,52.07
BP_1  (via drill 0.51)
  Top 0.203: R37.2 24.13,58 24.55,58.42 28.41,58.42 28.41,55.42 29.21,54.61 R39.1 v29.21,52.71 | IC5.7 46.67,42.8 49.27,42.8 v49.53,42.55 | v52.7,41.91 U4.2 53.37,44.55 53.37,44.95 53.98,45.55 53.98,46.36 52.7,47.62 U4.15 52.7,51.44 v52.07,52.07 | R46.1 51.82,37.29 C30.2 55.24,38.52 55.24,40.01 55.12,40.01 v54.99,39.87 | v49.53,31.75 50.16,31.11 Z4.2
  Bottom 0.203: v49.53,31.75 v49.53,42.55 52.07,42.55 v52.7,41.91 54.74,39.87 v54.99,39.87 | v52.07,52.07 50.62,53.52 35.86,53.52 35.05,52.71 v29.21,52.71
F_CONTROL  (via drill 0.51)
  Top 0.203: R9.2 C19.2 64.14,37.25 64.14,40.01 66.04,41.91 66.67,41.91 | 66.67,41.91 IC1.1 | 66.67,41.91 v66.67,40.64 | v82.55,40.64 IC2.6 v82.55,45.09 | v82.55,50.8 IC2.11
  Bottom 0.203: v66.67,40.64 v82.55,40.64 | v82.55,45.09 v82.55,50.8
F_CONTROL_1  (via drill 0.51)
  Top 0.203: R31.2 C29.2 11.43,37.89 11.43,40.64 13.34,42.55 13.97,42.55 | 13.97,42.55 IC6.1 | 13.97,42.55 v13.97,41.28 | v29.84,41.28 IC4.6 v29.84,45.72 | v29.84,51.44 IC4.11
  Bottom 0.203: v13.97,41.28 v29.84,41.28 | v29.84,45.72 v29.84,51.44
F_PWM  (via drill 0.51)
  Top 0.203: R23.3 6.99,15.88 6.99,6.98 12.06,1.91 59.05,1.91 60.5,3.35 v61.02,3.35 | U1.10 93.89,4.35 v93.34,3.81
  Bottom 0.203: v93.34,3.81 61.47,3.81 v61.02,3.35
F_PWM_1  (via drill 0.51)
  Top 0.203: U3.10 41.18,5.62 v40.64,5.08
  Bottom 0.203: R33.3 7.55,14.37 v8.95,13.51 8.95,9.7 14.84,3.81 39.37,3.81 v40.64,5.08
GND  (via drill 0.51)
  Top 0.203: C6.2 85.72,56.73 v85.72,57.15 | C14.2 78.74,56.1 v78.74,57.15 | C5.2 72.39,53.12 v72.39,52.25 | IC1.5 71.18,48.32 v71.75,48.9 | C4.2 v64.77,43.18 | IC1.3 v69.22,45.09 | IC2.8 86.3,41.91 v86.36,41.91 | v87,43.82 C7.1 88.47,45.51 C2.2 | IC3.10 v95.89,50.17 93.98,50.17 93.34,49.53 IC3.12 | Q2.2 101.07,57.15 v99.69,57.15 98.86,56.32 96.53,56.32 96.35,56.14 96.35,53.08 97.79,51.64 97.79,50.8 100.33,50.8 102.23,48.9 C17.2 100.76,45.94 C8.1 | U2.6 110.49,39.83 v110.03,39.37 | v104.78,22.22 105.9,22.22 C1.+ 106.68,23 C27.- | U1.12 95.48,14.37 v95.25,14.61 | U1.5 89.94,16.75 v88.9,17.78 89.47,18.34 U1.3 | U7.7 76.2,16.51 v76.83,15.88 | ISP_A.6 v64.14,12.06 | C28.2 73.24,26.04 v73.03,26.04 | C15.2 85.72,37.46 86.53,36.66 86.53,34.46 v84.45,32.38 | C32.2 33.02,57.37 v33.02,57.79 | C40.2 26.25,56.52 25.4,56.52 v25.4,57.15 | C33.2 19.68,53.76 v19.68,52.88 | IC6.5 18.48,48.96 v19.05,49.53 | C41.2 12.06,45.09 v11.43,44.45 | IC6.3 v16.51,45.72 | IC4.8 33.59,42.55 v33.66,42.55 | v34.29,44.45 C52.1 34.72,46.57 C43.2 | IC5.10 v43.18,50.8 41.92,50.8 41.3,50.18 41.3,49.62 IC5.12 | Q6.2 48.37,57.79 v46.99,57.79 | Q5.2 53.77,56.09 v55.24,54.61 | U4.8 60.33,41.98 60.96,41.34 v60.96,40.01 | U4.6 57.78,40.46 v57.33,40.01 | U3.12 42.78,15 v42.55,15.24 | U3.5 37.23,17.38 v36.2,18.41 | v24.13,16.51 23.5,17.14 U$7.7 20.95,17.14 20.95,19.68 U$7.5 | C56.2 20.54,26.67 v20.32,26.67 | C35.2 33.02,38.1 33.83,37.29 33.83,35.1 v31.75,33.02 | C54.+ 56.37,58.42 v55.88,58.42 | v106.05,58.42 106.36,58.11 Q1.2 107.2,53.98 v107.31,53.98 | IC5.5 v43.18,41.28 42.56,41.28 41.3,42.53 41.3,43.09 IC5.3 | C37.1 v32.38,11.43 C36.1 | C46.- 53.98,23.5 v52.7,23.5
  Top 0.203: C53.- 53.83,27.16 v52.7,26.04 | U7.5 76.07,20.32 v77.47,20.32 | C22.2 86.14,17.36 v85.72,17.78 85.31,17.36 C24.2 | C25.1 v85.09,10.16 C26.1 | C23.2 104.36,11.21 v104.78,10.79 | U1.21 98.03,17.54 v97.79,17.78 | IC3.5 v95.89,40.64 95.26,40.64 94.01,41.89 94.01,42.46 IC3.3 | C51.1 59.75,36.62 v61.41,38.28 | U3.3 36.76,18.98 v36.2,18.41 | C45.2 52.49,11.85 v52.7,12.06 | U3.21 45.32,18.18 v45.09,18.41 | C55.2 49.1,46.14 C49.1 48.02,45.75 v48.02,44.7 | C18.1 73.86,45.94 C9.2 74.93,44.87 v74.93,43.82 | C16.2 v83.19,34.29 | C38.2 C39.2 35.77,18 v36.2,18.41 | C34.2 29.84,35.98 v29.84,35.1 | v22.23,44.45 22.23,45.51 C42.2 21.16,46.57 C50.1 | v113.67,45.54 114.06,45.94 C13.1 115.23,45.94 117.25,43.92 117.25,42.95 116.84,42.55 113.67,42.55 | v112.39,41.28 113.67,42.55 | 113.67,42.55 113.67,42.61 U2.8 | C11.- 111.76,30.48 v113.03,31.75 114.3,33.02 JP2.3 | Z2.1 v19.68,29.21 | Z1.1 67.94,27.46 v67.94,27.3
  Bottom 0.203: JP2.3 117.47,31.11 117.47,25.4 v116.2,25.4 | JP4.1 114.3,10.16 v113.03,8.89 | v61.41,38.28 61.59,38.1 | 116.03,46.3 115.9,46.4 | v29.84,35.1 29.84,34.93 | v22.23,44.45 19.05,47.62 v19.05,49.53 | v74.93,43.82 71.75,46.99 v71.75,48.9 73.89,51.03 80.12,51.03 80.82,51.73 80.82,52.41 80.35,52.88 79.67,52.88 79.04,52.25 v72.39,52.25 | v113.67,45.54 113.67,45.72
  pour Bottom (isolate 0.254): 0.64,47.62 0.64,9.53 9.53,0.64 110.49,0.64 118.11,8.26 118.11,48.26 106.68,59.69 12.7,59.69
  pour Top (isolate 0.254): 0.64,47.62 0.64,9.53 9.53,0.64 110.49,0.64 118.11,8.26 118.11,48.26 106.68,59.69 12.7,59.69
HP  (via drill 0.51)
  Top 0.203: IC3.1 90.81,41.28 92.08,40.01 92.08,37.25 R17.1 R18.2 93.34,35.05 v93.98,34.42 | v109.86,45.09 109.22,44.45 U2.5 109.22,37.47 106.05,34.29 v99.69,34.29 | v106.68,50.17 U2.14
  Bottom 0.203: v109.86,45.09 106.68,48.26 v106.68,50.17 | v99.69,34.29 94.11,34.29 v93.98,34.42
HP_1  (via drill 0.51)
  Top 0.203: IC5.1 38.1,41.91 39.37,40.64 39.37,37.89 R36.1 R35.2 40.64,35.69 v41.27,35.05 | U4.5 56.52,43.82 56.52,43.64 | 56.52,43.64 56.52,38.1 53.34,34.93 v46.99,34.93 | v55.24,45.72 53.98,46.99 U4.14 | v56.97,41.91 56.97,43.18 56.52,43.64
  Bottom 0.203: v55.24,45.72 57.15,43.82 57.15,42.09 v56.97,41.91 | v46.99,34.93 41.4,34.93 v41.27,35.05
LEDS0
  Top 0.203: R25.2 97.89,25.28 97.89,24.22 97.08,23.43 U1.27
LEDS1_1
  Top 0.203: R49.2 45.18,25.91 45.18,23.59 44.38,22.79 U3.27
LP  (via drill 0.51)
  Top 0.203: C10.2 94.61,53.34 98.42,49.53 IC3.8 100.39,48.32 v100.97,48.9 | U2.1 104.14,41.28 | 104.14,41.28 104.14,40.64 104.78,40.01 107.31,40.01 107.95,40.64 U2.4 107.95,45.72 109.22,46.99 U2.12 U2.11 110.49,46.99 v109.86,46.36 | R21.2 v100.97,39.37 | v100.97,41.28 101.72,41.28 101.9,41.1 102.57,41.1 102.75,41.28 104.14,41.28
  Bottom 0.203: v100.97,39.37 v100.97,41.28 | v109.86,46.36 109.86,50.8 109.22,51.44 105.92,51.44 105.11,50.62 102.69,50.62 v100.97,48.9
LP_1  (via drill 0.51)
  Top 0.203: C31.2 42.76,54.4 45.72,51.44 IC5.8 47.69,48.96 v48.26,49.53 | U4.1 51.44,41.91 | 51.44,41.91 51.44,41.28 52.07,40.64 54.61,40.64 55.24,41.28 U4.4 55.24,44.52 56.52,45.79 U4.12 U4.11 57.78,50.29 v57.53,50.54 | R40.2 v48.26,40.01 | v48.26,41.91 49.02,41.91 49.19,41.73 49.87,41.73 50.04,41.91 51.44,41.91
  Bottom 0.203: v48.26,40.01 v48.26,41.91 | v48.26,49.53 49.99,51.26 52.41,51.26 53.22,52.07 56.52,52.07 56.89,51.69 56.89,51.18 v57.53,50.54
MI  (via drill 0.51)
  Top 0.203: JP4.3 117.47,13.33 117.47,8.89 116.56,7.98 113.84,7.98 109.24,3.38 100.34,3.38 99.48,4.23 R27.1 98.39,4.23 v96.93,2.77 | R54.1 46.35,4.87 46.88,4.34 47.31,4.34 47.63,4.01 48.89,4.01 49.21,4.34 58.31,4.34 58.42,4.45 v58.42,4.27
  Bottom 0.203: v58.42,4.27 58.6,4.45 92.83,4.45 93.01,4.62 95.07,4.62 v96.93,2.77
MISO
  Top 0.203: U1.16 98.69,9.15 98.42,8.89 R27.2 95.25,2.75 95.25,2.54 73.66,2.54 70.48,5.71 ISP_A.1
MISO_1
  Top 0.203: U3.16 45.98,9.79 45.72,9.53 R54.2 44.45,6.56 44.45,3.81 23.5,3.81 20.95,6.35 ISP_B.1
MO  (via drill 0.51)
  Top 0.203: JP4.4 114.3,17.78 106.68,10.16 R24.1 105.62,9.11 v105.41,8.89 | v73.03,12.7 67.31,18.41 60.33,18.41 60.33,13.97 56.09,9.74 R53.1 | v95.25,10.16 v95.25,6.35
  Bottom 0.203: v95.25,10.16 86.24,10.16 85.43,10.97 74.75,10.97 v73.03,12.7 | v95.25,6.35 95.71,6.81 105.11,6.81 105.29,6.98 105.41,6.98 105.41,7.11 105.59,7.28 105.59,7.96 105.41,8.13 v105.41,8.89
MOSI  (via drill 0.51)
  Top 0.203: U1.15 97.89,9.65 v97.53,9.3 | v104.78,7.62 106.47,7.62 R24.2
  Bottom 0.203: ISP_A.4 66.19,8.26 67.43,9.5 68.46,9.5 68.66,9.3 v97.53,9.3 103.1,9.3 v104.78,7.62
MOSI_1  (via drill 0.51)
  Top 0.203: U3.15 45.18,10.28 v44.83,9.93 | v52.07,8.26 53.76,8.26 R53.2
  Bottom 0.203: v52.07,8.26 50.39,9.93 v44.83,9.93 18.5,9.93 18.3,10.13 16.48,10.13 ISP_B.4
MUX_A
  Top 0.203: R7.1 89.53,56.1 91.86,58.42 103.93,58.42 Q1.3 105.41,54.47 105.98,53.9 106.12,53.9 107.31,52.71 109.86,52.71 110.49,52.07 111.76,52.07 113.03,50.8 113.79,50.8 113.96,50.98 114.64,50.98 115.11,50.5 115.11,47.8 113.67,46.36 112.39,46.36 111.76,46.99 U2.10
MUX_A_1
  Top 0.203: R58.1 36.83,56.73 39.16,59.05 51.86,59.05 Q5.3 53.55,58.21 60.96,50.8 60.96,46.99 59.69,46.99 59.05,47.62 U4.10
MUX_B
  Top 0.203: R8.1 99.69,55.46 Q2.3 102.87,55.25 102.87,54.75 102.94,54.68 102.94,53.9 104.6,52.25 105.75,52.25 107.19,50.8 111.76,50.8 113.03,49.53 U2.9
MUX_B_1
  Top 0.203: R59.1 46.98,56.1 Q6.3 50.16,55.88 53.98,52.07 58.42,52.07 60.33,50.17 U4.9
N$1
  Top 0.203: R20.1 94.83,32.38 88.87,32.38 C21.-
N$2  (via drill 0.51)
  Top 0.203: C20.+ 87.2,33.2 v93.98,33.2 | v99.69,33.02 106.05,33.02 111.12,38.1 111.12,49.53 110.49,50.17 108.58,50.17 107.95,49.53 U2.13
  Bottom 0.203: v93.98,33.2 99.52,33.2 v99.69,33.02
N$3
  Top 0.203: C29.1 R31.1 | R31.1 16.94,36.62 R32.2 19.48,38.32 R57.2 | R31.1 IC6.2
N$4  (via drill 0.51)
  Top 0.203: Q1.1 107.21,52.07 109.86,52.07 110.49,51.44 111.76,51.44 113.03,50.17 v114.3,50.17 | v116.2,48.26 116.2,46.87 117.65,45.42 117.65,35.88 116.09,34.32 112.42,34.32 109.22,31.11 109.22,29.21 102.23,22.22 102.23,19.68 101.69,19.14 U1.23
  Bottom 0.203: v114.3,50.17 v116.2,48.26
N$5
  Top 0.203: C20.- 78.11,33.05 R14.1
N$6  (via drill 0.51)
  Top 0.203: U1.24 100.19,26.52 v100.97,27.3 | v101.6,52.07 101.6,53.87 Q2.1
  Bottom 0.203: v100.97,27.3 100.97,38.1 97.61,41.45 97.61,48.08 v101.6,52.07
N$7  (via drill 0.51)
  Top 0.203: LED1.A 6.35,11.43 6.35,6.98 12.06,1.27 64.77,1.27 66.67,3.17 v66.67,12.06 | v92.08,27.3 92.71,27.94 92.71,30.48 93.98,31.75 99.69,31.75 99.69,28.79 R25.1
  Bottom 0.203: v66.67,12.06 81.92,27.3 v92.08,27.3
N$8  (via drill 0.51)
  Top 0.203: v17.14,40.01 17.78,39.37 R32.1 | R33.2 R33.1
  Bottom 0.203: v17.14,40.01 10.16,40.01 R33.1
N$9
  Top 0.203: R12.2 R11.1 69.28,32.23 Z1.2
N$10  (via drill 0.51)
  Top 0.203: LED2.A 5.71,7.62 5.71,6.98 11.84,0.86 101.19,0.86 102.87,2.54 v109.22,2.54 | v96.52,29.21 R26.1
  Bottom 0.203: v109.22,2.54 109.22,16.51 105.41,20.32 103.5,20.32 102.87,20.95 102.87,24.13 100.33,26.67 97.16,26.67 96.52,27.3 v96.52,29.21
N$11
  Top 0.203: U1.28 96.28,23.89 97.16,24.77 97.16,25.18 R26.2
N$12
  Top 0.203: R22.2 R21.1 R20.2 R19.1 95.05,35.98 R18.1 93.34,40.01 92.08,41.28 IC3.2
N$13  (via drill 0.51)
  Top 0.203: R52.1 C44.1 IC6.6 16.51,50.8 v22.23,50.8 | v27.3,45.72 IC4.4
  Bottom 0.203: v27.3,45.72 26.04,45.72 22.23,49.53 v22.23,50.8
N$14
  Top 0.203: R46.2 R40.1 R34.2 R38.1 42.34,36.62 R35.1 40.64,40.64 39.37,41.91 IC5.2
N$15
  Top 0.203: U7.3 78.11,17.78 77.47,17.14 77.47,16.51 78.08,15.9 81.89,15.9 83.19,17.19 83.19,17.78 84.55,19.14 U1.2
N$15_1
  Top 0.203: U$7.3 25.4,18.41 24.77,17.78 24.77,17.14 25.38,16.53 29.19,16.53 30.48,17.83 30.48,18.41 31.84,19.78 U3.2
N$16
  Top 0.203: U7.2 80.64,16.51 87,22.86 92.71,22.86 93.08,22.48 U1.32
N$16_1
  Top 0.203: U$7.2 27.94,17.14 34.29,23.5 40.01,23.5 40.38,23.12 U3.32
N$17
  Top 0.203: R4.1 C6.1
N$18  (via drill 0.51)
  Top 0.203: IC4.5 28.57,40.64 v29.21,40.01 | C30.1 52.28,38.32 49.52,41.08 44.65,41.08 44.45,41.28 | 44.45,41.28 IC5.6 | v44.45,39.37 44.45,41.28 | Z3.2 38.26,31.75 v38.73,31.75
  Bottom 0.203: v29.21,40.01 38.73,40.01 | 38.73,40.01 41.27,40.01 41.91,39.37 v44.45,39.37 | v38.73,31.75 38.73,40.01
N$19  (via drill 0.51)
  Top 0.203: IC2.5 81.28,40.01 v81.92,39.37 | C12.1 104.99,37.68 102.23,40.44 97.36,40.44 97.16,40.64 | 97.16,40.64 IC3.6 | v97.16,38.74 97.16,40.64 | Z5.2 90.17,30.48 v90.81,31.11
  Bottom 0.203: v81.92,39.37 90.81,39.37 | 90.81,39.37 93.98,39.37 94.61,38.74 v97.16,38.74 | v90.81,31.11 90.81,39.37
N$20
  Top 0.203: R39.2 30.48,56.1 | 30.48,56.1 R41.2 | IC4.10 31.11,52.07 30.48,52.71 30.48,56.1
N$21
  Top 0.203: R3.2 R2.1 77.47,53.12 IC2.15
N$22
  Top 0.203: IC4.12 28.57,47.32 31.45,47.32 31.75,47.62 31.75,50.15 32.4,50.8 37.06,50.8 37.69,51.44 37.69,56.74 39.37,58.42 40.64,58.42 41.91,57.15 C31.1 41.05,55.23 41.05,53.81 40.64,53.4 40.64,52.07 43.18,52.07 44.45,50.8 IC5.9
N$23  (via drill 0.51)
  Top 0.203: R29.1 95.48,24.95 U1.29 95.48,18.02 v94.61,17.14 | ISP_A.5 69.85,10.79 71.12,9.53 77.47,9.53 v81.28,13.33
  Bottom 0.203: v94.61,17.14 94.61,15.88 92.08,13.33 v81.28,13.33
N$24
  Top 0.203: R41.1 C32.1
N$25
  Top 0.203: U1.31 93.67,21.66 93.67,22.48 92.65,23.5 86.36,23.5 81.92,19.05 U7.4
N$25_1
  Top 0.203: U3.31 40.96,22.3 40.96,23.11 39.95,24.13 33.66,24.13 29.21,19.68 U$7.4
N$26
  Top 0.203: R5.2 83.19,55.46 | 83.19,55.46 R4.2 | IC2.10 83.82,51.44 83.19,52.07 83.19,55.46
N$27
  Top 0.203: C5.1 R3.1
N$28
  Top 0.203: IC2.12 81.28,46.69 84.15,46.69 84.45,46.99 84.45,49.52 85.1,50.17 89.76,50.17 90.4,50.8 90.4,56.11 92.08,57.79 93.34,57.79 94.61,56.52 C10.1 93.75,54.6 93.75,53.17 93.34,52.77 93.34,51.44 95.89,51.44 97.16,50.17 IC3.9
N$29
  Top 0.203: R16.2 89.97,37.68 R17.2 87.84,40.64 84.45,40.64 83.82,41.28 IC2.7
N$30
  Top 0.203: R16.1 87.21,37.68 86.35,38.54 85.1,38.54 84.24,37.68 C16.1
N$31  (via drill 0.51)
  Top 0.203: IC2.13 79.34,47.66 79.34,47.09 79.17,46.92 77.04,46.92 76.86,47.09 76.86,50.77 76.2,51.44 70.48,51.44 70.48,56.52 71.75,57.79 v71.75,58.42 | IC3.13 92.08,52.07 93.34,53.34 93.34,54.61 92.5,55.46 R6.1 93.24,56.62 v92.97,56.89
  Bottom 0.203: v71.75,58.42 91.44,58.42 v92.97,56.89
N$32
  Top 0.203: C33.1 R42.1
N$33
  Top 0.203: R43.2 37.26,38.32 R36.2 35.14,41.28 31.75,41.28 31.11,41.91 IC4.7
N$34
  Top 0.203: R43.1 34.5,38.32 33.65,39.17 32.39,39.17 31.54,38.32 C34.1
N$35
  Top 0.203: R44.1 27.94,34.93 29.95,32.91 33.02,35.98 C35.1
N$36
  Top 0.203: IC4.2 24.77,41.28 25.4,40.64 R47.2 R44.2
N$37
  Top 0.203: R42.2 R37.1 24.77,53.76 IC4.15
N$38  (via drill 0.51)
  Top 0.203: IC4.13 26.64,48.29 26.64,47.73 26.46,47.55 24.34,47.55 24.16,47.73 24.16,51.41 23.5,52.07 17.78,52.07 17.78,57.15 19.68,59.05 33.66,59.05 34.92,57.79 v35.56,57.79 | IC5.13 39.37,52.71 40.64,53.98 40.64,55.25 39.79,56.1 R45.1 40.53,57.26 v40.26,57.53
  Bottom 0.203: v40.26,57.53 39.88,57.15 36.2,57.15 v35.56,57.79
N$39  (via drill 0.51)
  Top 0.203: R38.2 43.18,40.01 42.55,40.64 v41.91,40.64 | R45.2 38.1,53.12 IC5.14 38.67,48.38 v38.67,47.24
  Bottom 0.203: v41.91,40.64 38.73,43.82 38.73,47.18 v38.67,47.24
N$40
  Top 0.203: C19.1 R9.1 | R9.1 69.64,35.98 R10.2 72.19,37.68 R11.2 | R9.1 IC1.2
N$41  (via drill 0.51)
  Top 0.203: v61.59,17.14 61.59,5.71 58.42,2.54 12.06,2.54 7.62,6.98 7.62,16.51 5.71,18.41 5.71,22.22 R23.1 R23.2 | v69.85,39.37 70.48,38.74 R10.1
  Bottom 0.203: v61.59,17.14 68.58,17.14 69.85,18.41 v69.85,39.37
N$42  (via drill 0.51)
  Top 0.203: Z4.1 50.16,25.4 48.26,23.5 v48.29,23.5 | v36.83,25.4 Z3.1
  Bottom 0.203: v48.29,23.5 46.35,23.5 42.55,27.3 40.64,27.3 38.73,25.4 v36.83,25.4
N$43
  Top 0.203: R34.1 42.12,33.02 36.16,33.02 C47.-
N$44
  Top 0.203: C48.- 25.4,33.69 R47.1
N$45
  Top 0.203: Q4.1 37.21,11.26 C37.2 37.05,13.14 U3.8
N$46
  Top 0.203: Q4.2 27.56,11.26 C36.2 31.54,15.24 36.83,15.24 37.4,15.81 38.85,15.81 U3.7
N$47  (via drill 0.51)
  Top 0.203: LED3.A 5.71,34.29 5.71,30.48 10.48,25.72 v10.79,26.04 | v39.37,27.94 40.01,28.57 40.01,29.21 43.18,32.38 46.99,32.38 46.99,29.43 R49.1
  Bottom 0.203: v10.79,26.04 12.7,27.94 v39.37,27.94
N$48  (via drill 0.51)
  Top 0.203: R19.2 95.89,39.37 95.25,40.01 v94.61,40.01 | v91.38,46.61 91.38,47.11 90.81,47.69 IC3.14 90.81,52.49 R6.2
  Bottom 0.203: v94.61,40.01 92.08,42.55 92.08,45.97 91.44,46.61 v91.38,46.61
N$49  (via drill 0.51)
  Top 0.203: LED4.A 10.16,25.4 10.16,5.08 12.06,3.17 57.15,3.17 v57.15,3.35 | v43.81,29.84 R50.1
  Bottom 0.203: v43.81,29.84 57.15,16.51 v57.15,3.35
N$50
  Top 0.203: R50.2 44.38,25.89 44.38,24.06 43.58,23.26 U3.28
N$51
  Top 0.203: R56.2 R57.1 15.46,31.75 15.24,31.75 14.76,31.27 Z2.2
N$52  (via drill 0.51)
  Top 0.203: R48.1 42.78,25.59 U3.29 42.78,18.65 v41.91,17.78 | v28.57,13.97 24.77,10.16 19.05,10.16 ISP_B.5
  Bottom 0.203: v41.91,17.78 41.91,16.51 39.37,13.97 v28.57,13.97
N$53  (via drill 0.51)
  Top 0.203: Q5.1 54.51,53.34 v57.15,53.34 | v61.59,52.71 62.23,52.07 62.23,37.31 59.84,34.93 57.78,34.93 55.88,33.02 52.86,33.02 51.44,31.6 51.44,25.4 49.53,23.5 49.53,20.32 48.99,19.78 U3.23
  Bottom 0.203: v61.59,52.71 60.96,53.34 v57.15,53.34
N$54  (via drill 0.51)
  Top 0.203: U3.24 47.48,27.16 v48.26,27.94 | v48.9,52.71 48.9,54.51 Q6.1
  Bottom 0.203: v48.26,27.94 48.26,38.74 44.91,42.09 44.91,48.72 v48.9,52.71
N$56  (via drill 0.51)
  Top 0.203: C48.+ 34.5,33.83 v41.27,33.83 | v46.99,33.66 53.34,33.66 58.42,38.74 58.42,50.8 57.78,51.44 55.88,51.44 55.24,50.8 U4.13
  Bottom 0.203: v41.27,33.83 46.81,33.83 v46.99,33.66
N$59  (via drill 0.51)
  Top 0.203: Z6.1 103.5,24.77 v101.6,22.86 | v90.81,24.77 90.17,25.4 Z5.1
  Bottom 0.203: v101.6,22.86 97.16,22.86 93.98,26.04 92.71,26.04 91.44,24.77 v90.81,24.77
N$65
  Top 0.203: R15.1 80.64,34.93 82.97,32.59 85.72,35.35 C15.1
N$67
  Top 0.203: IC2.2 77.47,40.64 78.11,40.01 R14.2 R15.2
N$77  (via drill 0.51)
  Top 0.203: R1.1 C3.1 IC1.6 69.22,50.17 v74.93,50.17 | v80.01,45.09 IC2.4
  Bottom 0.203: v80.01,45.09 78.74,45.09 74.93,48.9 v74.93,50.17
N$82
  Top 0.203: Q3.1 89.92,9.99 C26.2 89.75,12.51 U1.8
N$83
  Top 0.203: Q3.2 80.26,9.99 C25.2 84.88,14.61 89.53,14.61 90.11,15.18 91.55,15.18 U1.7
NET1
  Top 0.203: IC4.3 26.04,45.09 25.4,45.72 24.77,45.72 24.13,45.09 24.13,30.7 R60.2 C56.1
NET55
  Top 0.203: IC2.3 78.74,44.45 78.11,45.09 77.47,45.09 76.83,44.45 76.83,30.06 R30.2 C28.1
OSC
  Top 0.203: C21.+ 86.36,26.67 79.34,19.66 79.27,19.66 77.39,17.78 U7.6
OSC_1
  Top 0.203: C47.+ 33.66,27.3 26.64,20.29 26.56,20.29 24.69,18.41 U$7.6
OUT
  Top 0.203: IC1.7 67.94,50.17 65.41,52.71 65.41,55.25 65.62,55.46 R1.2 C3.2 69.22,57.15 71.3,59.23 72.09,59.23 72.27,59.05 105.53,59.05 105.71,59.23 106.38,59.23 109.86,55.76 R64.2
OUT_1
  Top 0.203: IC6.7 15.24,50.8 12.7,53.34 12.7,55.88 12.91,56.1 | 12.91,56.1 13.34,56.1 R52.2 C44.2 | 12.91,56.1 R62.2
OUTA  (via drill 0.51)
  Top 0.203: v117.47,46.99 117.47,48.26 115.52,50.22 115.52,50.67 114.75,51.44 112.97,51.44 111.93,52.48 110.72,52.48 109.86,53.34 R64.1
  Bottom 0.203: v117.47,46.99 117.47,44.96 117.65,44.79 117.65,42.72 JP2.6
OUTB  (via drill 0.51)
  Top 0.203: R62.1 10.16,55.67 10.16,56.52 12.06,58.42 v13.34,58.42
  Bottom 0.203: v13.34,58.42 32.51,58.42 33.32,59.23 104.08,59.23 105.71,57.61 107.49,57.61 114.12,50.98 114.64,50.98 118.29,47.33 118.29,46.02 118.11,45.84 118.11,39.37 116.84,38.1 JP2.5
RES_CONTROL  (via drill 0.51)
  Top 0.203: C14.1 78.74,53.12 78.74,50.8 | IC2.14 78.74,50.8 | R13.2 62.87,30.7 62.87,49.53 v64.14,50.8 | v80.01,52.07 78.74,50.8
  Bottom 0.203: v80.01,52.07 79.38,51.44 65.41,51.44 64.77,50.8 v64.14,50.8
RES_CONTROL_1  (via drill 0.51)
  Top 0.203: C40.1 26.04,53.76 26.04,51.44 | IC4.14 26.04,51.44 | R51.2 10.16,31.33 10.16,50.17 v11.43,51.44 | v27.3,52.71 26.04,51.44
  Bottom 0.203: v27.3,52.71 26.67,52.07 12.7,52.07 12.06,51.44 v11.43,51.44
RES_PWM  (via drill 0.51)
  Top 0.203: U1.9 92.31,12.06 v92.08,12.06 | v74.93,12.06 74.93,12.7 69.85,17.78 69.85,23.28 65.41,27.72 R13.1
  Bottom 0.203: v92.08,12.06 v74.93,12.06
RES_PWM_1  (via drill 0.51)
  Top 0.203: U3.9 39.6,12.7 v39.37,12.7 | R51.1 12.7,27.09 12.7,16.51 13.97,15.24 v17.78,15.24
  Bottom 0.203: v17.78,15.24 20.32,12.7 v39.37,12.7
SC  (via drill 0.51)
  Top 0.203: JP4.2 114.3,12.7 111.12,9.53 111.12,6.35 109.86,5.08 101.81,5.08 R28.1 101.01,4.19 v102.87,4.19 | R55.1 48.48,5.08 59.05,5.08 v59.69,5.71 | v62.87,5.26 64.77,3.35 v64.77,2.54
  Bottom 0.203: v59.69,5.71 62.41,5.71 v62.87,5.26 | v64.77,2.54 71.75,2.54 73.03,1.27 99.95,1.27 v102.87,4.19
SCK  (via drill 0.51)
  Top 0.203: U1.17 100.97,13.56 100.97,7.62 | R28.2 100.97,7.62 | v99.69,7.62 100.97,7.62
  Bottom 0.203: v99.69,7.62 68.58,7.62 ISP_A.3
SCK_1  (via drill 0.51)
  Top 0.203: U3.17 48.26,14.2 48.26,8.26 | R55.2 48.26,8.26 | v46.99,8.26 48.26,8.26
  Bottom 0.203: v46.99,8.26 18.41,8.26 ISP_B.3
SS  (via drill 0.51)
  Top 0.203: R63.2 108.17,5.71 102.87,5.71 102.23,6.35 v102.23,11.43 | v96.52,10.16 97.16,10.79 97.16,12.78 U1.14
  Bottom 0.203: v102.23,11.43 100.97,10.16 v96.52,10.16
SS_1
  Top 0.203: R61.2 43.18,10.79 44.45,12.06 44.45,13.41 U3.14
SSA
  Top 0.203: R63.1 109.86,9.74 111.35,11.24 111.35,12.78 115.11,16.54 116.09,16.54 116.81,17.26 116.81,20.84 115.57,22.08 JP4.6
SSB  (via drill 0.51)
  Top 0.203: R61.1 v43.18,5.08 | v68.58,1.68 97.56,1.68 v98.42,2.54 | v107.95,13.33 109.37,14.76 110.69,14.76 113.51,17.58 113.51,18.26 JP4.5
  Bottom 0.203: v43.18,5.08 43.81,5.08 47.22,1.68 v68.58,1.68 | v98.42,2.54 102.23,6.35 105.41,6.35 106.68,7.62 106.68,12.7 107.31,13.33 v107.95,13.33
VCA_CONTROL
  Top 0.203: R30.1 73.03,23.28 73.03,15.88 73.66,15.24 U7.8
VCA_CONTROL_1
  Top 0.203: R60.1 20.32,23.91 20.32,16.51 20.95,15.88 U$7.8
VCC  (via drill 0.51)
  Top 0.356: JP2.4 112.25,35.56 C11.+ 107.17,32.88 v108.58,34.29 | 94.61,44.6 98.88,44.6 99.25,44.24 C17.1 103.08,45.09 v105.41,45.09 104.14,46.36 U2.16 100.27,52.07 98.84,52.07 R8.2 | 94.61,44.6 90.35,44.6 89.98,44.24 C2.1 v88.9,42.55 86.98,42.55 86.73,42.8 86.36,42.8 85.91,43.25 85.91,44.24 83.94,46.2 76.2,46.2 76.2,46.84 | 76.2,46.84 74.66,46.84 C9.1 71.31,47.21 70.94,46.84 66.67,46.84 | 76.2,46.84 IC2.16 | 66.67,46.84 65.14,46.84 C4.1 63.5,45.94 63.5,33.2 v63.68,33.02 | IC1.8 66.67,46.84 | 94.61,44.6 IC3.4 | R7.2 89.53,52.71 v88.9,52.07 | 41.91,45.24 46.18,45.24 47.81,43.6 48.26,43.6 C55.1 50.38,45.72 v52.7,45.72 51.44,46.99 U4.16 47.56,52.71 46.14,52.71 R59.2 | 41.91,45.24 37.64,45.24 37.28,44.87 C43.1 v36.2,43.18 34.28,43.18 34.02,43.43 33.66,43.43 33.21,43.88 33.21,44.87 31.24,46.84 23.5,46.84 IC4.16 22.38,47.84 C42.1 21.39,47.64 18.4,47.64 18.24,47.47 13.97,47.47 | C41.1 12.43,47.47 13.97,47.47 | IC6.8 13.97,47.47 | 41.91,45.24 IC5.4 | R58.2 36.83,53.34 v36.2,52.71 | v57.78,33.02 57.93,32.88 C53.+ v60.33,29.84
  Bottom 0.356: v108.58,34.29 108.58,43.82 107.31,45.09 v105.41,45.09 | v88.9,52.07 v88.9,42.55 | v52.7,45.72 53.98,45.72 55.88,43.82 55.88,34.93 v57.78,33.02 | v36.2,52.71 v36.2,43.18 | v60.33,29.84 63.5,33.02 v63.68,33.02
VEE  (via drill 0.51)
  Top 0.356: JP2.2 114.3,30.48 113.67,29.84 113.67,27.3 111.27,24.91 C1.- 111.27,18.56 v110.49,17.78 | v116.2,43.82 115.78,44.24 C13.2 113.82,44.24 113.44,44.61 111.76,44.61 U2.7 | IC1.4 71.6,44.24 C18.2 72.39,42.55 | C8.2 99.25,47.21 98.88,46.84 98.42,46.84 | 98.42,46.84 94.61,46.84 | v98.42,45.72 98.42,46.84 | 94.61,46.84 IC3.11 | R12.1 72.39,40.86 72.39,42.55 | v85.09,46.36 IC2.9 86.2,47.21 C7.2 89.35,47.21 90.35,46.2 90.35,46.18 90.81,45.72 93.34,45.72 94.46,46.84 94.61,46.84 | v74.3,42.55 72.39,42.55 | IC6.4 18.89,44.87 C50.2 19.68,43.18 | C49.2 46.54,47.84 46.18,47.47 45.72,47.47 | 45.72,47.47 41.91,47.47 | v45.72,46.36 45.72,47.47 | 41.91,47.47 IC5.11 | R56.1 19.68,41.49 19.68,43.18 | v32.38,46.99 IC4.9 33.5,47.84 C52.2 36.64,47.84 37.64,46.84 37.64,46.81 38.1,46.36 40.64,46.36 41.76,47.47 41.91,47.47 | v20.95,43.18 19.68,43.18 | C51.2 59.05,38.95 U4.7 59.05,44.39 61.02,46.36 61.59,46.36 61.59,51.44 60.33,52.71 60.33,54.47 C54.- 62.38,56.66 v64.14,58.42
  Bottom 0.356: v110.49,17.78 110.49,38.1 111.12,38.74 112.39,38.74 113.67,40.01 113.67,41.91 114.3,42.55 116.2,42.55 v116.2,43.82 109.86,43.82 107.31,46.36 99.06,46.36 v98.42,45.72 | v85.09,46.36 81.28,42.55 v74.3,42.55 68.62,48.22 62.87,48.22 | v32.38,46.99 28.57,43.18 v20.95,43.18 | v45.72,46.36 47.58,48.22 62.87,48.22 | 62.87,48.22 62.87,57.15 v64.14,58.42

### Text on the board
tPlace: V/Oct | V/Oct
tNames: NOTE B | DATA B | Dual Ambika SVF | Voice Card | Roots Electronics 2021 | NOTE A | DATA A
tValues: Z4.7V | Z3.6V | Z3.6V | Z3.6V | Z4.7V
200bmp: cc-by-sa